# Altium project LimeSDR-PCIe_1v3.PrjPcb (part 2 of 7)

## Sheet 06_LMS7002M_RF2.SchDoc: LMS7002M RF
size A3; Organization: Lime Microsystems; Address1: Surrey Tech Centre; Address2: Guildford GU2 7YG; Address3: Surrey; Address4: United Kingdom; Revision: v1.3; SheetNumber: 6; SheetTotal: 16
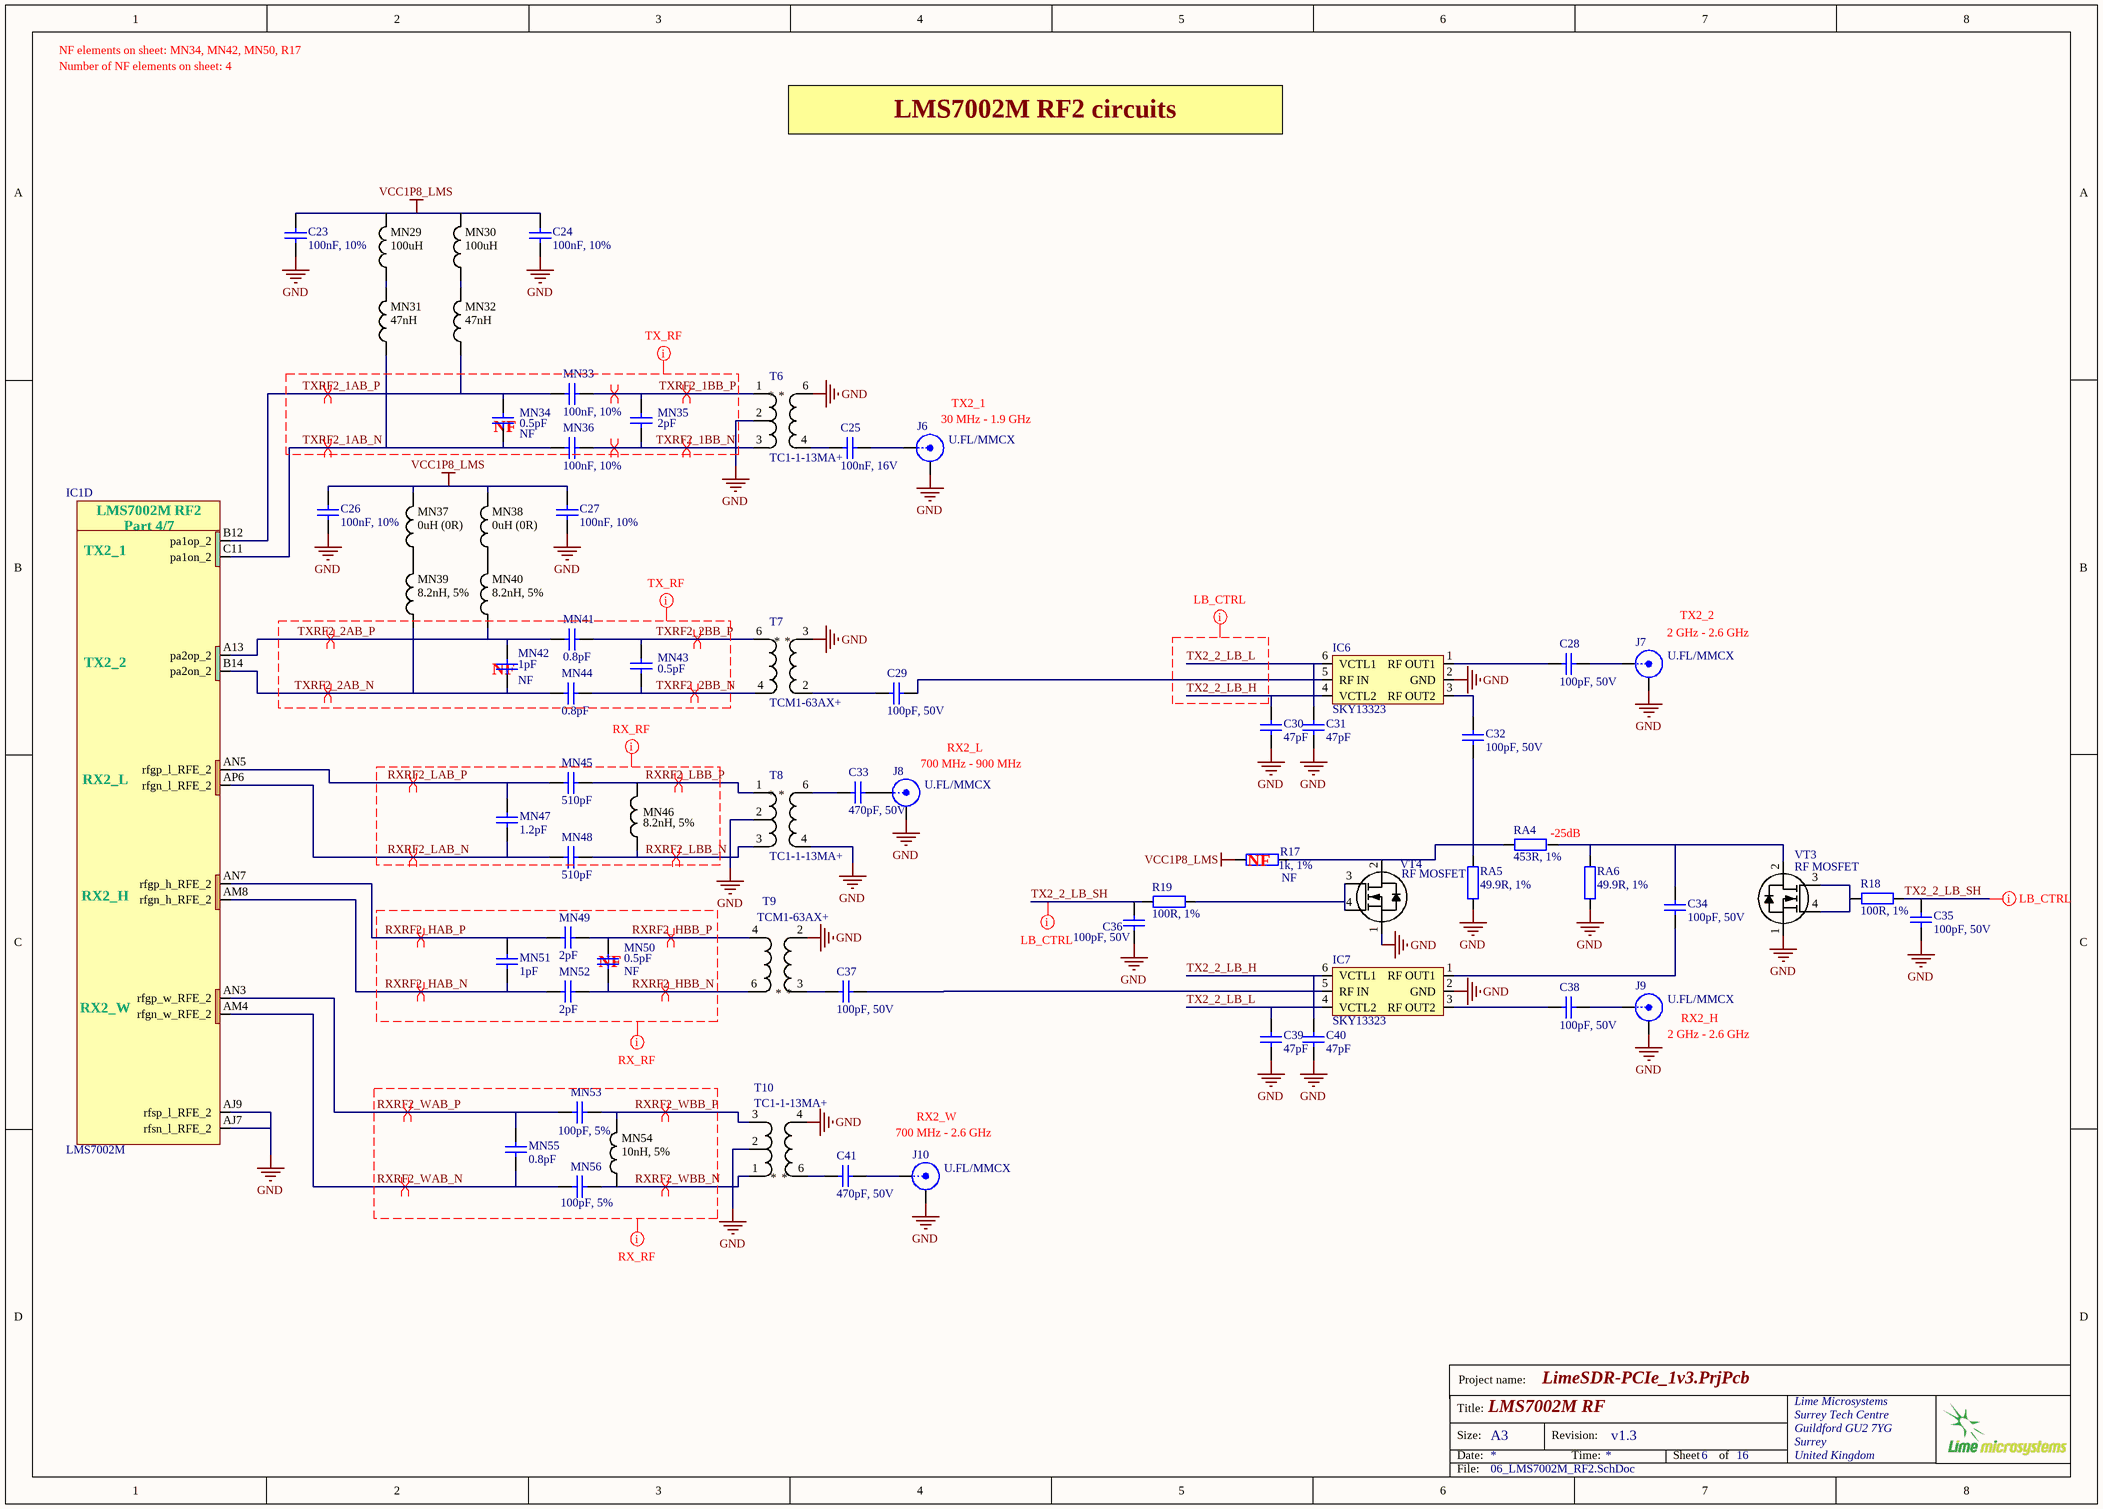
[diagram p5: 06_LMS7002M_RF2.SchDoc]

### Parts
C23  100nF, 10%  [CAP0402]
C24  100nF, 10%  [CAP0402]
C25  100nF, 16V  [CAP0402]
C26  100nF, 10%  [CAP0402]
C27  100nF, 10%  [CAP0402]
C28  100pF, 50V  [CAP0402]
C29  100pF, 50V  [CAP0402]
C30  47pF  [CAP0402]
C31  47pF  [CAP0402]
C32  100pF, 50V  [CAP0402]
C33  470pF, 50V  [CAP0402]
C34  100pF, 50V  [CAP0402]
C35  100pF, 50V  [CAP0402]
C36  100pF, 50V  [CAP0402]
C37  100pF, 50V  [CAP0402]
C38  100pF, 50V  [CAP0402]
C39  47pF  [CAP0402]
C40  47pF  [CAP0402]
C41  470pF, 50V  [CAP0402]
IC1  LMS7002M  [LMS7002M_v2]  (part D of 7)
IC6  SKY13323  [SKY13323-378LF]
IC7  SKY13323  [SKY13323-378LF]
J6  U.FL/MMCX  [MMCX_UFL_conn_u]
J7  U.FL/MMCX  [MMCX_UFL_conn_u]
J8  U.FL/MMCX  [MMCX_UFL_conn_u]
J9  U.FL/MMCX  [MMCX_UFL_conn_u]
J10  U.FL/MMCX  [MMCX_UFL_conn_u]
MN29  100uH  [RES0805]
MN30  100uH  [RES0805]
MN31  47nH  [RES0402]
MN32  47nH  [RES0402]
MN33  100nF, 10%  [CAP0402]
MN34  0.5pF  Assembly Info: NF  [CAP0402]
MN35  2pF  [CAP0402]
MN36  100nF, 10%  [CAP0402]
MN37  0uH (0R)  [RES0805]
MN38  0uH (0R)  [RES0805]
MN39  8.2nH, 5%  [RES0402]
MN40  8.2nH, 5%  [RES0402]
MN41  0.8pF  [CAP0402]
MN42  1pF  Assembly Info: NF  [CAP0402]
MN43  0.5pF  [CAP0402]
MN44  0.8pF  [CAP0402]
MN45  510pF  [CAP0402]
MN46  8.2nH, 5%  [RES0402]
MN47  1.2pF  [CAP0402]
MN48  510pF  [CAP0402]
MN49  2pF  [CAP0402]
MN50  0.5pF  Assembly Info: NF  [CAP0402]
MN51  1pF  [CAP0402]
MN52  2pF  [CAP0402]
MN53  100pF, 5%  [CAP0402]
MN54  10nH, 5%  [RES0402]
MN55  0.8pF  [CAP0402]
MN56  100pF, 5%  [CAP0402]
R17  1k, 1%  Assembly Info: NF  [RES0402]
R18  100R, 1%  [RES0402]
R19  100R, 1%  [RES0402]
RA4  453R, 1%  [RES0402]
RA5  49.9R, 1%  [RES0402]
RA6  49.9R, 1%  [RES0402]
T6  TC1-1-13MA+  [TC1-1-13MA+_v2]
T7  TCM1-63AX+  [TCM1-63AX+_v2]
T8  TC1-1-13MA+  [TC1-1-13MA+_v2]
T9  TCM1-63AX+  [TCM1-63AX+_v2]
T10  TC1-1-13MA+  [TC1-1-13MA+_v2]
VT3  RF MOSFET  [BF1105R_SOT143R4]
VT4  RF MOSFET  [BF1105R_SOT143R4]

### Nets
GND: C23.1 C24.1 C26.1 C27.1 C30.1 C31.1 C35.2 C36.2 C39.1 C40.1 IC1.AJ7(rfsn_l_RFE_2) IC1.AJ9(rfsp_l_RFE_2) IC6.2(GND) IC7.2(GND) J6.2(Y) J7.2(Y) J8.2(Y) J9.2(Y) J10.2(Y) RA5.1 RA6.1 T6.2 T6.6 T7.3 T8.2 T8.4 T9.2 T10.2 T10.4 VT3.1(S) VT4.1(S)
VCC1P8_LMS: C23.2 C24.2 C26.2 C27.2 MN29.2 MN30.2 MN37.2 MN38.2 R17.2
RXRF2_HAB_N: IC1.AM8(rfgn_h_RFE_2) MN51.1 MN52.2
RXRF2_HAB_P: IC1.AN7(rfgp_h_RFE_2) MN49.2 MN51.2
RXRF2_HBB_N: MN50.1 MN52.1 T9.6
RXRF2_HBB_P: MN49.1 MN50.2 T9.4
RXRF2_LAB_N: IC1.AP6(rfgn_l_RFE_2) MN47.1 MN48.2
RXRF2_LAB_P: IC1.AN5(rfgp_l_RFE_2) MN45.2 MN47.2
RXRF2_LBB_N: MN46.1 MN48.1 T8.3
RXRF2_LBB_P: MN45.1 MN46.2 T8.1
RXRF2_WAB_N: IC1.AM4(rfgn_w_RFE_2) MN55.2 MN56.2
RXRF2_WAB_P: IC1.AN3(rfgp_w_RFE_2) MN53.2 MN55.1
RXRF2_WBB_N: MN54.1 MN56.1 T10.1
RXRF2_WBB_P: MN53.1 MN54.2 T10.3
TX2_2_LB_H: C30.2 C40.2 IC6.4(VCTL2) IC7.6(VCTL1)
TX2_2_LB_L: C31.2 C39.2 IC6.6(VCTL1) IC7.4(VCTL2)
TX2_2_LB_SH: C35.1 C36.1 R18.1 R19.2
TXRF2_1AB_N: IC1.C11(pa1on_2) MN31.1 MN34.1 MN36.1
TXRF2_1AB_P: IC1.B12(pa1op_2) MN32.1 MN33.2 MN34.2
TXRF2_1BB_N: MN35.1 MN36.2 T6.3
TXRF2_1BB_P: MN33.1 MN35.2 T6.1
TXRF2_2AB_N: IC1.B14(pa2on_2) MN39.1 MN42.2 MN44.2
TXRF2_2AB_P: IC1.A13(pa2op_2) MN40.1 MN41.2 MN42.1
TXRF2_2BB_N: MN43.1 MN44.1 T7.4
TXRF2_2BB_P: MN41.1 MN43.2 T7.6
NetC25_1: C25.1 J6.1(X)
NetC25_2: C25.2 T6.4
NetC28_1: C28.1 J7.1(X)
NetC28_2: C28.2 IC6.1(RF_OUT1)
NetC29_1: C29.1 IC6.5(RF_IN)
NetC29_2: C29.2 T7.2
NetC32_1: C32.1 IC6.3(RF_OUT2)
NetC32_2: C32.2 R17.1 RA4.1 RA5.2 VT4.2(D)
NetC33_1: C33.1 J8.1(X)
NetC33_2: C33.2 T8.6
NetC34_1: C34.1 RA4.2 RA6.2 VT3.2(D)
NetC34_2: C34.2 IC7.1(RF_OUT1)
NetC37_1: C37.1 IC7.5(RF_IN)
NetC37_2: C37.2 T9.3
NetC38_1: C38.1 J9.1(X)
NetC38_2: C38.2 IC7.3(RF_OUT2)
NetC41_1: C41.1 J10.1(X)
NetC41_2: C41.2 T10.6
NetMN29_1: MN29.1 MN31.2
NetMN30_1: MN30.1 MN32.2
NetMN37_1: MN37.1 MN39.2
NetMN38_1: MN38.1 MN40.2
NetR18_2: R18.2 VT3.3(G2) VT3.4(G1)
NetR19_1: R19.1 VT4.3(G2) VT4.4(G1)

### Layout directives
differential pair: RXRF2_HAB_N, RXRF2_HAB_P, RXRF2_HBB_N, RXRF2_HBB_P, RXRF2_LAB_N, RXRF2_LAB_P, RXRF2_LBB_N, RXRF2_LBB_P, RXRF2_WAB_N, RXRF2_WAB_P, RXRF2_WBB_N, RXRF2_WBB_P, TXRF2_1AB_N, TXRF2_1AB_P, TXRF2_1BB_N, TXRF2_1BB_P, TXRF2_2AB_N, TXRF2_2AB_P, TXRF2_2BB_N, TXRF2_2BB_P
net class TX_RF: TXRF2_1AB_N, TXRF2_1AB_P, TXRF2_1BB_N, TXRF2_1BB_P, TXRF2_2AB_N, TXRF2_2AB_P, TXRF2_2BB_N, TXRF2_2BB_P
net class RX_RF: RXRF2_HAB_N, RXRF2_HAB_P, RXRF2_HBB_N, RXRF2_HBB_P, RXRF2_LAB_N, RXRF2_LAB_P, RXRF2_LBB_N, RXRF2_LBB_P, RXRF2_WAB_N, RXRF2_WAB_P, RXRF2_WBB_N, RXRF2_WBB_P
net class LB_CTRL: TX2_2_LB_H, TX2_2_LB_L, TX2_2_LB_SH

### Notes on the sheet
- Number of NF elements on sheet: 4
- NF elements on sheet: MN34, MN42, MN50, R17
- LMS7002M RF2 circuits
- (near MN34) NF
- (near J6) 30 MHz - 1.9 GHz
- (near J6) TX2_1
- (near J7) 2 GHz - 2.6 GHz
- (near J7) TX2_2
- (near MN42) NF
- (near J8) 700 MHz - 900 MHz
- RX2_L
- (near RA4) -25dB
- (near R17) NF
- (near MN50) NF
- (near J9) 2 GHz - 2.6 GHz
- (near J9) RX2_H
- (near J10) RX2_W
- 700 MHz - 2.6 GHz
- Project name:
- Title:
- Size:
- Date:
- A3
- Revision:
- Time:
- Sheet
- of
- File:
- (in symbol LMS7002Mr3, part D) LMS7002M RF2; Part 4/7; TX2_1; TX2_2; RX2_L; RX2_H; RX2_W

### Library data of the parts
C23 C24 C26 C27 = Cap_0402: Manufacturer: Murata Electronics; Manufacturer Part Number: GRM155R71C104KA88D; Part Description: 0.10µF ±10% 16V X7R Ceramic Capacitor -55°C ~ 125°C Surface Mount, MLCC 0402 (1005 Metric) 0.039" L x 0.020" W (1.00mm x 0.50mm); Voltage Rating DC: 16 V; Type: General Purpose MLCC; Capacitance: 0.1 uF; Case Length: 1 mm; Dielectric: X7R; Case Height: 0.5 mm; Temperature Coefficient / Code: +/- 15 %; Value: 100nF, 10%; Supplier 1: Mouser; Supplier Part Number 1: 81-GRM155R71C104KA88; Case Code - in: 0402; RoHS: RoHS Compliant; Operating Temperature Range: - 55 C to + 125 C; Series: GRM; Termination Style: SMD/SMT; Tolerance: 10 %; Package / Case: 0402 (1005 metric); Maximum Operating Temperature: + 125 C; Case Code - mm: 1005; Minimum Operating Temperature: - 55 C; Product Category: Low & Medium Capacitance SMD Ceramic Chip Capacitors; Packaging: Reel; Product: General Type MLCCs; Category: Multilayer Ceramic Capacitors MLCC - SMD/SMT; Brand: Murata Electronics; Case Width: 0.5 mm; RoHS - Mouser: Y; Standard Pack Qty: 10000; Minimum Order Quantity: 1; Reeling: True; Manufacturer Part Number 1: GRM155R71C104KA88D
C25 = Cap_0402: Manufacturer: Murata Electronics; Manufacturer Part Number: GRM155R71C104KA88D; Part Description: 0.10µF ±10% 16V X7R Ceramic Capacitor -55°C ~ 125°C Surface Mount, MLCC 0402 (1005 Metric) 0.039" L x 0.020" W (1.00mm x 0.50mm); Tolerance: 10 %; Type: General Purpose MLCC; Capacitance: 0.1 uF; Case Length: 1 mm; Dielectric: X7R; Case Height: 0.5 mm; Temperature Coefficient / Code: +/- 15 %; Value: 100nF, 16V; Supplier 1: Mouser; Supplier Part Number 1: 81-GRM155R71C104KA88; Case Code - in: 0402; RoHS: RoHS Compliant; Operating Temperature Range: - 55 C to + 125 C; Series: GRM; Termination Style: SMD/SMT; Package / Case: 0402 (1005 metric); Voltage Rating DC: 16 V; Maximum Operating Temperature: + 125 C; Case Code - mm: 1005; Minimum Operating Temperature: - 55 C; Product Category: Low & Medium Capacitance SMD Ceramic Chip Capacitors; Packaging: Reel; Product: General Type MLCCs; Category: Multilayer Ceramic Capacitors MLCC - SMD/SMT; Brand: Murata Electronics; Case Width: 0.5 mm; RoHS - Mouser: Y; Standard Pack Qty: 10000; Minimum Order Quantity: 1; Reeling: True; Manufacturer Part Number 1: GRM155R71C104KA88D
C28 C29 C32 C34-C38 = Cap_0402: Manufacturer Part Number 1: CC0402JRNPO9BN101; Manufacturer: Yageo; Part Description: 100pF ±5% 50V C0G, NP0 Ceramic Capacitor -55°C ~ 125°C Surface Mount, MLCC 0402 (1005 Metric) 0.039" L x 0.020" W (1.00mm x 0.50mm); Tolerance: ±5%; Temperature Coefficient: C0G, NP0; Value: 100pF, 50V; Capacitance: 100pF; Thickness (Max): 0.022" (0.55mm); Size / Dimension: 0.039" L x 0.020" W (1.00mm x 0.50mm); RoHS: RoHS Compliant; Ratings: -; Package / Case: 0402 (1005 Metric); Mounting Type: Surface Mount, MLCC; Height - Seated (Max): -; Features: -; Lead Spacing: -; Voltage - Rated: 50V; Operating Temperature: -55°C ~ 125°C; Packaging: Cut Tape (CT); Applications: General Purpose; Lead Style: -; Supplier 1: Digi-Key; Category: Capacitors; Supplier Part Number 1: 311-1024-1-ND
C30 C31 C39 C40 = Cap_0402: Manufacturer Part Number 1: C1005C0G1H470F050BA; Manufacturer: TDK Corporation; Part Description: 47pF ±1% 50V C0G, NP0 Ceramic Capacitor -55°C ~ 125°C Surface Mount, MLCC 0402 (1005 Metric) 0.039" L x 0.020" W (1.00mm x 0.50mm); Voltage - Rated: 50V; Temperature Coefficient: C0G, NP0; Tolerance: ±1%; Value: 47pF; Supplier 1: Digi-Key; Supplier Part Number 1: 445-5361-1-ND; Package / Case: 0402 (1005 Metric); Lead Spacing: -; Ratings: -; Mounting Type: Surface Mount, MLCC; Operating Temperature: -55°C ~ 125°C; Thickness (Max): 0.022" (0.55mm); Capacitance: 47pF; Packaging: Cut Tape (CT); Features: -; Applications: General Purpose; Lead Style: -; Size / Dimension: 0.039" L x 0.020" W (1.00mm x 0.50mm); Height - Seated (Max): -; RoHS: RoHS Compliant; Category: Capacitors
C33 C41 = Cap_0402: Manufacturer Part Number: C1005C0G1H471J050BA; Manufacturer: TDK Corporation; Part Description: 470pF ±5% 50V C0G, NP0 Ceramic Capacitor -55°C ~ 125°C Surface Mount, MLCC 0402 (1005 Metric) 0.039" L x 0.020" W (1.00mm x 0.50mm); Tolerance: ±5%; Temperature Coefficient: C0G, NP0; Value: 470pF, 50V; Supplier 1: Digi-Key; Supplier Part Number 1: 445-2656-6-ND; Ratings: -; Package / Case: 0402 (1005 Metric); Capacitance: 470pF; Packaging: Digi-Reel®; RoHS: RoHS Compliant; Lead Style: -; Thickness (Max): 0.022" (0.55mm); Size / Dimension: 0.039" L x 0.020" W (1.00mm x 0.50mm); Lead Spacing: -; Operating Temperature: -55°C ~ 125°C; Height - Seated (Max): -; Applications: General Purpose; Mounting Type: Surface Mount, MLCC; Voltage - Rated: 50V; Category: Capacitors; Features: -
IC1 = LMS7002Mr3: Schematic symbol revision 3. Default footprint - 0.31mm pad; Manufacturer: Lime Microsystems; Part Description: IC FPRF Transceiver LMS7002M; 261 pin aQFN; Supplier 1: Lime Microsystems; Supplier Part Number 1: LMS7002M; Manufacturer Part Number 1: LMS7002M
IC6 IC7 = SKY13323: SKY13323-378LF: 0.1-3.0 GHz GaAs SPDT Switch; Manufacturer: Skyworks Solutions Inc.; Part Description: IC SPDT 100MHZ-3GHZ 6-MLPD; Frequency - Lower: 100MHz; P1dB: 27dBm (typ) IP1dB; Isolation @ Frequency: 27dB @ 3GHz (typ); RF Type: 802.11b/g; Impedance: 50 Ohm; IIP3: 50dBm (typ); Topology: Reflective; Insertion Loss @ Frequency: 0.35dB @ 3GHz; Frequency - Upper: 3GHz; Supplier 1: Digi-Key; Operating Temperature: -40°C ~ 85°C; RoHS: RoHS Compliant; Package / Case: 6-XFDFN Exposed Pad; Circuit: SPDT; Features: -; Supplier Device Package: 6-MLPD (1x1); Category: RF/IF and RFID; Packaging: Cut Tape (CT); Manufacturer Part Number 1: SKY13323-378LF; Supplier Part Number 1: 683-1334-1-ND
J6-J10 = RF_IF_connector: CONN UMC RCPT STR 50 OHM SMD; Manufacturer: Molex, LLC; Manufacturer Part Number 1: 0734120110; Body Finish: Nickel; Body Material: Phosphor Bronze; Center Contact Material: Brass; Center Contact Plating: Gold; Connector Style: Ultra Miniature Coaxial; Connector Type: Jack, Male Pin; Contact Termination: Solder; Dielectric Material: Liquid Crystal Polymer (LCP); Frequency - Max: 6GHz; Impedance: 50 Ohm; Voltage Rating: 60V; Cable Group: -; Category: Connectors, Interconnects; Fastening Type: Snap-On; Features: -; Housing Color: Silver; Ingress Protection: -; Mounting Type: Surface Mount; Operating Temperature: -40°C ~ 90°C; Packaging: Cut Tape (CT); RoHS: RoHS Compliant; Shield Termination: Solder; Supplier 1: Digi-Key; Supplier Part Number 1: WM5587CT-ND; Part Description: CONN UMC RCPT STR 50 OHM SMD
MN29 MN30 = Inductor_0603: Manufacturer: TDK Corporation; Manufacturer Part Number: MLF2012C101KT000; Part Description: FIXED IND 100UH 2MA 3.1 OHM SMD; Q @ Freq: 25 @ 1MHz; Shielding: Shielded; Current Rating: 2mA; Frequency - Self Resonant: 7MHz; Frequency - Test: 1MHz; Material - Core: Ferrite; Tolerance: ±10%; Inductance: 100µH; DC Resistance (DCR): 3.1 Ohm Max; Value: 100uH; Supplier 1: Digi-Key; Supplier Part Number 1: 445-1071-1-ND; Supplier Device Package: 0805 (2012 Metric); Size / Dimension: 0.079" L x 0.049" W (2.00mm x 1.25mm); Operating Temperature: -40°C ~ 85°C; Packaging: Cut Tape (CT); RoHS: RoHS Compliant; Current - Saturation: -; Height - Seated (Max): 0.057" (1.45mm); Package / Case: 0805 (2012 Metric); Mounting Type: Surface Mount; Type: Multilayer; Category: Inductors, Coils, Chokes
MN31 MN32 = Inductor_0603: Manufacturer: COILCRAFT; Manufacturer Part Number: 0402HP-47NXJLU; Part Description: Surface Mount High Frequency Inductor, 0402HP Series, 47 nH, ± 5%, 0402 [1005 Metric], 2.4 GHz; SVHC: No SVHC (15-Jun-2015); Inductance Tolerance: ± 5%; High Frequency Inductor Case: 0402 [1005 Metric]; Inductor Case Style: 0402 [1005 Metric]<!--FANDB--><div class="features-and-benefits-container"></div>; Inductance: 47; DC Resistance Max: 0.58; Self Resonant Frequency Min: 2.4; Product Range: 0402; DC Current Rating: 420; Inductor Construction: Wirewound; Supplier 1: Farnell; Supplier Part Number 1: 2285856; Packaging: Cut Tape; RoHS: Y-EX; value: 47nH
MN33 MN36 = Cap_0402: Manufacturer: Murata Electronics; Manufacturer Part Number: GRM155R71C104KA88D; Part Description: 0.10µF ±10% 16V X7R Ceramic Capacitor -55°C ~ 125°C Surface Mount, MLCC 0402 (1005 Metric) 0.039" L x 0.020" W (1.00mm x 0.50mm); Voltage Rating DC: 16 V; Capacitance: 0.1 uF; Case Length: 1 mm; Dielectric: X7R; Case Height: 0.5 mm; Temperature Coefficient / Code: +/- 15 %; Value: 100nF, 10%; Supplier 1: Mouser; Supplier Part Number 1: 81-GRM155R71C104KA88; Case Code - in: 0402; RoHS: RoHS Compliant; Operating Temperature Range: - 55 C to + 125 C; Series: GRM; Termination Style: SMD/SMT; Tolerance: 10 %; Package / Case: 0402 (1005 metric); Type: General Purpose MLCC; Maximum Operating Temperature: + 125 C; Case Code - mm: 1005; Minimum Operating Temperature: - 55 C; Product Category: Low & Medium Capacitance SMD Ceramic Chip Capacitors; Packaging: Reel; Product: General Type MLCCs; Category: Multilayer Ceramic Capacitors MLCC - SMD/SMT; Brand: Murata Electronics; Case Width: 0.5 mm; RoHS - Mouser: Y; Standard Pack Qty: 10000; Minimum Order Quantity: 1; Reeling: True; Manufacturer Part Number 1: GRM155R71C104KA88D
MN34 MN43 MN50 = Cap_0402: Manufacturer: Yageo; Manufacturer Part Number 1: CC0402CRNPO9BNR50; Part Description: 0.50pF ±0.25pF 50V C0G, NP0 Ceramic Capacitor -55°C ~ 125°C Surface Mount, MLCC 0402 (1005 Metric) 0.039" L x 0.020" W (1.00mm x 0.50mm); Capacitance: 0.50pF; Voltage - Rated: 50V; Temperature Coefficient: C0G, NP0; Tolerance: ±0.25pF; Value: 0.5pF; Supplier 1: Digi-Key; Supplier Part Number 1: 311-1001-1-ND; RoHS: RoHS Compliant; Thickness (Max): 0.022" (0.55mm); Features: -; Height - Seated (Max): -; Lead Spacing: -; Applications: General Purpose; Packaging: Cut Tape (CT); Ratings: -; Size / Dimension: 0.039" L x 0.020" W (1.00mm x 0.50mm); Lead Style: -; Mounting Type: Surface Mount, MLCC; Operating Temperature: -55°C ~ 125°C; Package / Case: 0402 (1005 Metric); Category: Capacitors
MN35 MN49 MN52 = Cap_0402: Manufacturer Part Number: 04025U2R0BAT2A; Manufacturer: AVX; Part Description: SMD Multilayer Ceramic Capacitor, U Series, 2 pF, ± 0.1pF, C0G / NP0, 50 V, 0402 [1005 Metric]; Product Range: U Series; Voltage Rating: 50; SVHC: No SVHC (17-Dec-2014); Capacitance Tolerance: ± 0.1; Ceramic Capacitor Case: 0402 [1005 Metric]; Capacitance: 2; Dielectric Characteristic: C0G / NP0; Value: 2pF; Supplier 1: Farnell; Supplier Part Number 1: 2332536; Operating Temperature Max: 125; RoHS: YES; Operating Temperature Min: -55; Capacitance Tolerance ±: ± 0.1; Packaging: Cut Tape; MSL: MSL 1 - Unlimited
MN37 MN38 = Inductor_0603: Manufacturer: BOURNS; Manufacturer Part Number: CR0805-J/-000ELF; Part Description: Surface Mount Chip Resistor, Thick Film, CR Series, 0 ohm, 125 mW, ± 5%, 150 V, 0805 [2012 Metric]; Value: 0uH (0R); Supplier 1: Farnell; Supplier Part Number 1: 2008388; RoHS: YES
MN39 MN40 MN46 = Inductor_0603: Manufacturer: COILCRAFT; Manufacturer Part Number 1: 0402HP-8N2XJLU; Part Description: Surface Mount High Frequency Inductor, 0402HP Series, 8.2 nH, ± 5%, 0402 [1005 Metric], 5.4 GHz; Inductor Construction: Wirewound; DC Current Rating: 1.5; Inductor Case Style: 0402 [1005 Metric]<!--FANDB--><div class="features-and-benefits-container"></div>; Self Resonant Frequency Min: 5.4; DC Resistance Max: 0.065; High Frequency Inductor Case: 0402 [1005 Metric]; SVHC: No SVHC (16-Jun-2014); Inductance: 8.2; Supplier 1: Farnell; Supplier Part Number 1: 2285826; Packaging: Cut Tape; Product Range: COILCRAFT - 0402; Inductance Tolerance: ± 5%; RoHS: Y-EX; Value: 8.2nH, 5%
MN41 MN44 MN55 = Cap_0402: Manufacturer: Murata Electronics North America; Manufacturer Part Number: GRM1555C1HR80BA01D; Part Description: 0.80pF ±0.1pF 50V C0G, NP0 Ceramic Capacitor -55°C ~ 125°C Surface Mount, MLCC 0402 (1005 Metric) 0.039" L x 0.020" W (1.00mm x 0.50mm); Temperature Coefficient: C0G, NP0; Capacitance: 0.80pF; Voltage - Rated: 50V; Tolerance: ±0.1pF; Value: 0.8pF; Applications: General Purpose; Operating Temperature: -55°C ~ 125°C; Size / Dimension: 0.039" L x 0.020" W (1.00mm x 0.50mm); Features: -; Supplier 1: Digi-Key; Height - Seated (Max): -; Category: Capacitors; Package / Case: 0402 (1005 Metric); Mounting Type: Surface Mount, MLCC; Lead Spacing: -; Thickness (Max): 0.022" (0.55mm); RoHS: RoHS Compliant; Supplier Part Number 1: 490-6269-1-ND; Packaging: Cut Tape (CT); Ratings: -; Lead Style: -
MN42 MN51 = Cap_0402: Manufacturer: TDK Corporation; Manufacturer Part Number 1: C1005C0G1H010B050BA; Part Description: 1pF ±0.1pF 50V C0G, NP0 Ceramic Capacitor -55°C ~ 125°C Surface Mount, MLCC 0402 (1005 Metric) 0.039" L x 0.020" W (1.00mm x 0.50mm); Voltage - Rated: 50V; Temperature Coefficient: C0G, NP0; Tolerance: ±0.1pF; Value: 1pF; Supplier 1: Digi-Key; Supplier Part Number 1: 445-4854-6-ND; Size / Dimension: 0.039" L x 0.020" W (1.00mm x 0.50mm); Lead Spacing: -; Operating Temperature: -55°C ~ 125°C; Thickness (Max): 0.022" (0.55mm); Package / Case: 0402 (1005 Metric); Features: -; Lead Style: -; Applications: General Purpose; Height - Seated (Max): -; Capacitance: 1pF; RoHS: RoHS Compliant; Mounting Type: Surface Mount, MLCC; Packaging: Digi-Reel®; Ratings: -; Category: Capacitors
MN45 MN48 = Cap_0402: Manufacturer: Murata Electronics North America; Manufacturer Part Number: GRM1555C1H511JA01D; Part Description: 510pF ±5% 50V C0G, NP0 Ceramic Capacitor -55°C ~ 125°C Surface Mount, MLCC 0402 (1005 Metric) 0.039" L x 0.020" W (1.00mm x 0.50mm); Voltage - Rated: 50V; Temperature Coefficient: C0G, NP0; Tolerance: ±5%; Value: 510pF; Supplier 1: Digi-Key; Supplier Part Number 1: 490-3237-1-ND; Height - Seated (Max): -; Features: -; Size / Dimension: 0.039" L x 0.020" W (1.00mm x 0.50mm); Applications: General Purpose; Lead Spacing: -; Package / Case: 0402 (1005 Metric); Ratings: -; Thickness (Max): 0.022" (0.55mm); Lead Style: -; Operating Temperature: -55°C ~ 125°C; Mounting Type: Surface Mount, MLCC; Capacitance: 510pF; Category: Capacitors; RoHS: RoHS Compliant; Packaging: Cut Tape (CT)
MN47 = Cap_0402: Manufacturer: Murata Electronics North America; Manufacturer Part Number: GRM1555C1H1R2CA01D; Part Description: 1.2pF ±0.25pF 50V C0G, NP0 Ceramic Capacitor -55°C ~ 125°C Surface Mount, MLCC 0402 (1005 Metric) 0.039" L x 0.020" W (1.00mm x 0.50mm); Temperature Coefficient: C0G, NP0; Voltage - Rated: 50V; Tolerance: ±0.25pF; Value: 1.2pF; Supplier 1: Digi-Key; Supplier Part Number 1: 490-5927-1-ND; Lead Style: -; Category: Capacitors; Features: -; Packaging: Cut Tape (CT); Operating Temperature: -55°C ~ 125°C; Package / Case: 0402 (1005 Metric); Applications: General Purpose; Size / Dimension: 0.039" L x 0.020" W (1.00mm x 0.50mm); Lead Spacing: -; Ratings: -; Mounting Type: Surface Mount, MLCC; RoHS: RoHS Compliant; Height - Seated (Max): -; Thickness (Max): 0.022" (0.55mm); Capacitance: 1.2pF
MN53 MN56 = Cap_0402: Manufacturer Part Number 1: CC0402JRNPO9BN101; Manufacturer: Yageo; Part Description: 100pF ±5% 50V C0G, NP0 Ceramic Capacitor -55°C ~ 125°C Surface Mount, MLCC 0402 (1005 Metric) 0.039" L x 0.020" W (1.00mm x 0.50mm); Temperature Coefficient: C0G, NP0; Voltage - Rated: 50V; Value: 100pF, 5%; Capacitance: 100pF; Thickness (Max): 0.022" (0.55mm); Size / Dimension: 0.039" L x 0.020" W (1.00mm x 0.50mm); Tolerance: ±5%; RoHS: RoHS Compliant; Ratings: -; Package / Case: 0402 (1005 Metric); Mounting Type: Surface Mount, MLCC; Height - Seated (Max): -; Features: -; Lead Spacing: -; Operating Temperature: -55°C ~ 125°C; Packaging: Cut Tape (CT); Applications: General Purpose; Lead Style: -; Supplier 1: Digi-Key; Category: Capacitors; Supplier Part Number 1: 311-1024-1-ND
MN54 = Inductor_0603: Manufacturer Part Number 1: 0402HP-10NXJLU; Manufacturer: COILCRAFT; Part Description: Surface Mount High Frequency Inductor, 0402HP Series, 10 nH, ± 5%, 0402 [1005 Metric], 4.7 GHz; Value: 10nH, 5%; Supplier 1: Farnell; Supplier Part Number 1: 2285830; RoHS: Y-EX
R17 = Res_0402: Manufacturer: Stackpole Electronics Inc; Manufacturer Part Number 1: RMCF0402FT1K00; Part Description: RES SMD 1K OHM 1% 1/16W 0402; Temperature Coefficient: ±100ppm/°C; Power (Watts): 0.063W, 1/16W; Value: 1k, 1%; Supplier 1: Digi-Key; Supplier Part Number 1: RMCF0402FT1K00TR-ND; Resistance (Ohms): 1k; Packaging: Tape & Reel (TR); Category: Resistors; RoHS: RoHS Compliant; Tolerance: ±1%; Height: 0.016" (0.40mm); Number of Terminations: 2; Package / Case: 0402 (1005 Metric); Operating Temperature: -55°C ~ 155°C; Features: -; Composition: Thick Film; Supplier Device Package: 0402; Size / Dimension: 0.039" L x 0.020" W (1.00mm x 0.50mm)
R18 R19 = Res_0402: Manufacturer Part Number 1: RMCF0402FT100R; Part Description: RES SMD 100 OHM 1% 1/16W 0402; Manufacturer: Stackpole Electronics Inc.; Temperature Coefficient: ±100ppm/°C; Supplier 1: Digi-Key; Supplier Part Number 1: RMCF0402FT100RDKR-ND; Package / Case: 0402 (1005 Metric); Composition: Thick Film; Category: Resistors; Tolerance: ±1%; Value: 100R, 1%
RA4 = Res_0402: Manufacturer Part Number 1: RC0402FR-07453RL; Manufacturer: Yageo; Part Description: RES SMD 453 OHM 1% 1/16W 0402; Temperature Coefficient: ±100ppm/°C; Power (Watts): 0.063W, 1/16W; Resistance (Ohms): 453; Size / Dimension: 0.039" L x 0.020" W (1.00mm x 0.50mm); Height: 0.016" (0.40mm); Number of Terminations: 2; Failure Rate: -; Package / Case: 0402 (1005 Metric); Supplier Device Package: 0402; Supplier Part Number 1: YAG3165CT-ND; Supplier 1: Digi-Key; Part Status: Active; Category: Resistors; RoHS: RoHS Compliant; Packaging: Cut Tape (CT); Operating Temperature: -55°C ~ 155°C; Features: Moisture Resistant; Composition: Thick Film; Tolerance: ±1%; Value: 453R, 1%
RA5 RA6 = Res_0402: as R6 on sheet 04_LMS7002M_Misc; Number of Terminations: 2; Size / Dimension: 0.039" L x 0.020" W (1.00mm x 0.50mm); Supplier Device Package: 0402 (1005 Metric); RoHS: RoHS Compliant; Supplier Part Number 1: 1276-3469-6-ND; Features: -; Packaging: Digi-Reel®; Tolerance: ±1%; Height: 0.016" (0.40mm); Category: Resistors; Composition: Thick Film; Package / Case: 0402 (1005 Metric); Supplier 1: Digi-Key; Operating Temperature: -55°C ~ 155°C; Value: 49.9R, 1%
T6 T8 T10 = Balun: Manufacturer: Mini-Circuits; Part Description: RF balun, TC1-1-13MA+; Manufacturer Part Number 1: TC1-1-13MA+; Supplier Part Number 1: TC1-1-13MA+; Supplier 1: Minicircuits
T7 T9 = Balun_v2: Manufacturer: Mini-circuits; Part Description: RF balun, TCM1-63AX+; Supplier Part Number 1: TCM1-63AX+; Manufacturer Part Number 1: TCM1-63AX+; Supplier 1: Minicircuits
VT3 VT4 = BF1105R,215: Manufacturer: NXP Semiconductors; Part Description: RF MOSFET Transistors Trans MOSFET N-CH 7V 0.03A 4pin(3+Tab); Voltage - Rated: 7V; Noise Figure: 1.7dB; Current Rating: 30mA; Gain: 20dB; Transistor Type: N-Channel Dual Gate; Frequency: 800MHz; Voltage - Test: 5V; Supplier 1: Digi-Key; RoHS: RoHS Compliant; Supplier Device Package: SOT-143R; Power - Output: -; Current - Test: -; Manufacturer Part Number 1: BF1105R,215; Packaging: Digi-Reel®; Package / Case: SOT-143R; Category: Discrete Semiconductor Products; Supplier Part Number 1: 568-12530-6-ND

## Sheet 07_LMS7002M_Power.SchDoc: LMS7002M power supply
size A3 portrait; Organization: Lime Microsystems; Address1: Surrey Tech Centre; Address2: Guildford GU2 7YG; Address3: Surrey; Address4: United Kingdom; Revision: v1.3; SheetNumber: 7; SheetTotal: 16; PageSetup: Record=PageOptions|CenterHorizontal=True|CenterVertical=True|PrintScale=0.70|XCorrection=1.00|YCorrection=1.00|PrintKind=1|BorderSize=5000000|LeftOffset=0|BottomOffset=0|Orientation=1|PaperLength=2970|PaperWidth=2100|Scale=100|PaperSource=7|PrintQuality=600|MediaType=1|DitherType=10|PrintScaleMode=1|PaperKind=A4|PaperIndex=9
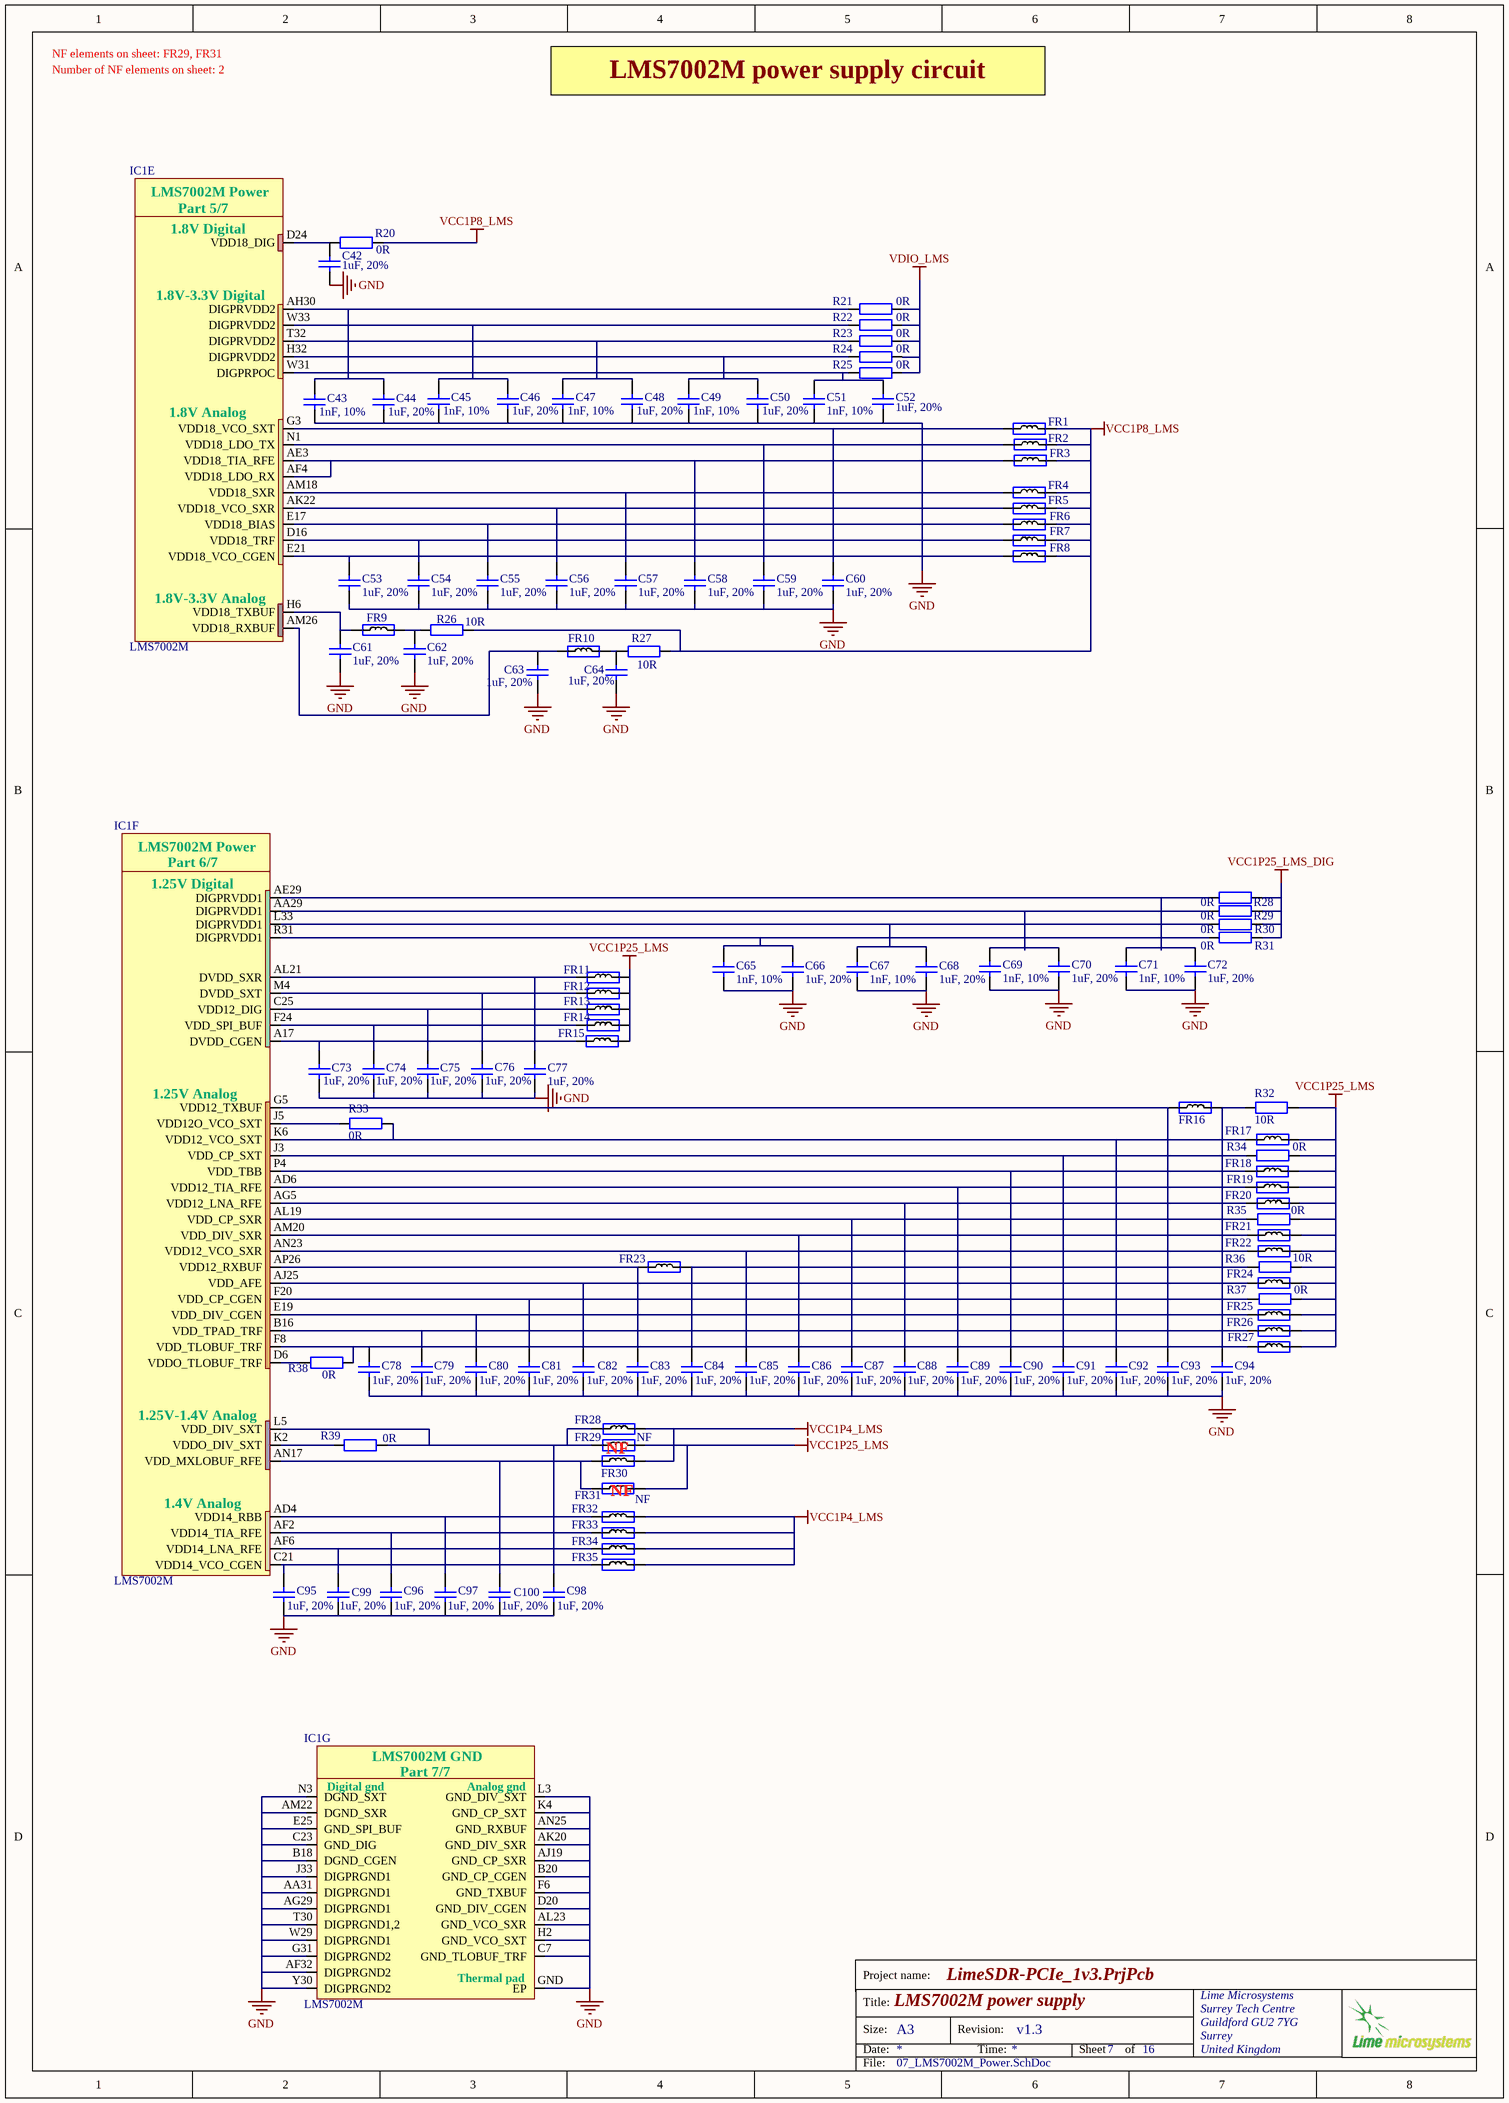
[diagram p6: 07_LMS7002M_Power.SchDoc]

### Parts
C42  1uF, 20%  [CAP0201]
C43  1nF, 10%  [CAP0201]
C44  1uF, 20%  [CAP0201]
C45  1nF, 10%  [CAP0201]
C46  1uF, 20%  [CAP0201]
C47  1nF, 10%  [CAP0201]
C48  1uF, 20%  [CAP0201]
C49  1nF, 10%  [CAP0201]
C50  1uF, 20%  [CAP0201]
C51  1nF, 10%  [CAP0201]
C52  1uF, 20%  [CAP0201]
C53  1uF, 20%  [CAP0201]
C54  1uF, 20%  [CAP0201]
C55  1uF, 20%  [CAP0201]
C56  1uF, 20%  [CAP0201]
C57  1uF, 20%  [CAP0201]
C58  1uF, 20%  [CAP0201]
C59  1uF, 20%  [CAP0201]
C60  1uF, 20%  [CAP0201]
C61  1uF, 20%  [CAP0201]
C62  1uF, 20%  [CAP0201]
C63  1uF, 20%  [CAP0201]
C64  1uF, 20%  [CAP0201]
C65  1nF, 10%  [CAP0201]
C66  1uF, 20%  [CAP0201]
C67  1nF, 10%  [CAP0201]
C68  1uF, 20%  [CAP0201]
C69  1nF, 10%  [CAP0201]
C70  1uF, 20%  [CAP0201]
C71  1nF, 10%  [CAP0201]
C72  1uF, 20%  [CAP0201]
C73  1uF, 20%  [CAP0201]
C74  1uF, 20%  [CAP0201]
C75  1uF, 20%  [CAP0201]
C76  1uF, 20%  [CAP0201]
C77  1uF, 20%  [CAP0201]
C78  1uF, 20%  [CAP0201]
C79  1uF, 20%  [CAP0201]
C80  1uF, 20%  [CAP0201]
C81  1uF, 20%  [CAP0201]
C82  1uF, 20%  [CAP0201]
C83  1uF, 20%  [CAP0201]
C84  1uF, 20%  [CAP0201]
C85  1uF, 20%  [CAP0201]
C86  1uF, 20%  [CAP0201]
C87  1uF, 20%  [CAP0201]
C88  1uF, 20%  [CAP0201]
C89  1uF, 20%  [CAP0201]
C90  1uF, 20%  [CAP0201]
C91  1uF, 20%  [CAP0201]
C92  1uF, 20%  [CAP0201]
C93  1uF, 20%  [CAP0201]
C94  1uF, 20%  [CAP0201]
C95  1uF, 20%  [CAP0201]
C96  1uF, 20%  [CAP0201]
C97  1uF, 20%  [CAP0201]
C98  1uF, 20%  [CAP0201]
C99  1uF, 20%  [CAP0201]
C100  1uF, 20%  [CAP0201]
FR1  600R, 0.27A  [RES0201]  (value not drawn)
FR2  600R, 0.27A  [RES0201]  (value not drawn)
FR3  600R, 0.27A  [RES0201]  (value not drawn)
FR4  600R, 0.27A  [RES0201]  (value not drawn)
FR5  600R, 0.27A  [RES0201]  (value not drawn)
FR6  600R, 0.27A  [RES0201]  (value not drawn)
FR7  600R, 0.27A  [RES0201]  (value not drawn)
FR8  600R, 0.27A  [RES0201]  (value not drawn)
FR9  600R, 0.27A  [RES0201]  (value not drawn)
FR10  600R, 0.27A  [RES0201]  (value not drawn)
FR11  600R, 0.27A  [RES0201]  (value not drawn)
FR12  600R, 0.27A  [RES0201]  (value not drawn)
FR13  600R, 0.27A  [RES0201]  (value not drawn)
FR14  600R, 0.27A  [RES0201]  (value not drawn)
FR15  600R, 0.27A  [RES0201]  (value not drawn)
FR16  600R, 0.27A  [RES0201]  (value not drawn)
FR17  600R, 0.27A  [RES0201]  (value not drawn)
FR18  600R, 0.27A  [RES0201]  (value not drawn)
FR19  600R, 0.27A  [RES0201]  (value not drawn)
FR20  600R, 0.27A  [RES0201]  (value not drawn)
FR21  600R, 0.27A  [RES0201]  (value not drawn)
FR22  600R, 0.27A  [RES0201]  (value not drawn)
FR23  600R, 0.27A  [RES0201]  (value not drawn)
FR24  600R, 0.27A  [RES0201]  (value not drawn)
FR25  600R, 0.27A  [RES0201]  (value not drawn)
FR26  600R, 0.27A  [RES0201]  (value not drawn)
FR27  600R, 0.27A  [RES0201]  (value not drawn)
FR28  600R, 0.27A  [RES0201]  (value not drawn)
FR29  Assembly Info: NF  [RES0201]  (hidden comment: 600R, 0.27A)
FR30  600R, 0.27A  [RES0201]  (value not drawn)
FR31  Assembly Info: NF  [RES0201]  (hidden comment: 600R, 0.27A)
FR32  600R, 0.27A  [RES0201]  (value not drawn)
FR33  600R, 0.27A  [RES0201]  (value not drawn)
FR34  600R, 0.27A  [RES0201]  (value not drawn)
FR35  600R, 0.27A  [RES0201]  (value not drawn)
IC1  LMS7002M  [LMS7002M_v2]  (parts E,F,G of 7)
R20  0R  [RES0201]
R21  0R  [RES0402]
R22  0R  [RES0402]
R23  0R  [RES0402]
R24  0R  [RES0402]
R25  0R  [RES0402]
R26  10R  [RES0201]
R27  10R  [RES0201]
R28  0R  [RES0402]
R29  0R  [RES0402]
R30  0R  [RES0402]
R31  0R  [RES0402]
R32  10R  [RES0201]
R33  0R  [RES0201]
R34  0R  [RES0201]
R35  0R  [RES0201]
R36  10R  [RES0201]
R37  0R  [RES0201]
R38  0R  [RES0201]
R39  0R  [RES0201]

### Nets
GND: C42.2 C43.2 C44.2 C45.2 C46.2 C47.2 C48.2 C49.2 C50.2 C51.2 C52.2 C53.2 C54.2 C55.2 C56.2 C57.2 C58.2 C59.2 C60.2 C61.2 C62.2 C63.2 C64.2 C65.2 C66.2 C67.2 C68.2 C69.2 C70.2 C71.2 C72.2 C73.2 C74.2 C75.2 C76.2 C77.2 C78.2 C79.2 C80.2 C81.2 C82.2 C83.2 C84.2 C85.2 C86.2 C87.2 C88.2 C89.2 C90.2 C91.2 C92.1 C93.2 C94.2 C95.2 C96.2 C97.2 C98.2 C99.2 C100.2 IC1.AA31(DIGPRGND1) IC1.AF32(DIGPRGND2) IC1.AG29(DIGPRGND1) IC1.AJ19(GND_CP_SXR) IC1.AK20(GND_DIV_SXR) IC1.AL23(GND_VCO_SXR) IC1.AM22(DGND_SXR) IC1.AN25(GND_RXBUF) IC1.B18(DGND_CGEN) IC1.B20(GND_CP_CGEN) IC1.C7(GND_TLOBUF_TRF) IC1.C23(GND_DIG) IC1.D20(GND_DIV_CGEN) IC1.E25(GND_SPI_BUF) IC1.F6(GND_TXBUF) IC1.G31(DIGPRGND2) IC1.GND(EP) IC1.H2(GND_VCO_SXT) IC1.J33(DIGPRGND1) IC1.K4(GND_CP_SXT) IC1.L3(GND_DIV_SXT) IC1.N3(DGND_SXT) IC1.T30(DIGPRGND1,2) IC1.W29(DIGPRGND1) IC1.Y30(DIGPRGND2)
VCC1P4_LMS: FR28.1 FR30.2 FR32.2 FR33.2 FR34.2 FR35.2
VCC1P8_LMS: FR1.2 FR2.1 FR3.1 FR4.2 FR5.2 FR6.2 FR7.2 FR8.2 R20.2 R26.2 R27.1
VCC1P25_LMS: FR11.1 FR12.1 FR13.1 FR14.1 FR15.2 FR17.1 FR18.1 FR19.1 FR20.1 FR21.2 FR22.2 FR24.2 FR25.2 FR26.2 FR27.2 FR29.1 FR31.2 R32.2 R34.2 R35.1 R36.1 R37.1
VCC1P25_LMS_DIG: R28.2 R29.2 R30.2 R31.2
VDIO_LMS: R21.1 R22.1 R23.1 R24.1 R25.1
NetC42_1: C42.1 IC1.D24(VDD18_DIG) R20.1
NetC43_1: C43.1 C44.1 IC1.AH30(DIGPRVDD2) R21.2
NetC45_1: C45.1 C46.1 IC1.W33(DIGPRVDD2) R22.2
NetC47_1: C47.1 C48.1 IC1.T32(DIGPRVDD2) R23.2
NetC49_1: C49.1 C50.1 IC1.H32(DIGPRVDD2) R24.2
NetC51_1: C51.1 C52.1 IC1.W31(DIGPRPOC) R25.2
NetC53_1: C53.1 FR8.1 IC1.E21(VDD18_VCO_CGEN)
NetC54_1: C54.1 FR7.1 IC1.D16(VDD18_TRF)
NetC55_1: C55.1 FR6.1 IC1.E17(VDD18_BIAS)
NetC56_1: C56.1 FR5.1 IC1.AK22(VDD18_VCO_SXR)
NetC57_1: C57.1 FR4.1 IC1.AM18(VDD18_SXR)
NetC58_1: C58.1 FR3.2 IC1.AE3(VDD18_TIA_RFE) IC1.AF4(VDD18_LDO_RX)
NetC59_1: C59.1 FR2.2 IC1.N1(VDD18_LDO_TX)
NetC60_1: C60.1 FR1.1 IC1.G3(VDD18_VCO_SXT)
NetC61_1: C61.1 FR9.2 IC1.H6(VDD18_TXBUF)
NetC62_1: C62.1 FR9.1 R26.1
NetC63_1: C63.1 FR10.1 IC1.AM26(VDD18_RXBUF)
NetC64_1: C64.1 FR10.2 R27.2
NetC65_1: C65.1 C66.1 IC1.R31(DIGPRVDD1) R31.1
NetC67_1: C67.1 C68.1 IC1.L33(DIGPRVDD1) R30.1
NetC69_1: C69.1 C70.1 IC1.AA29(DIGPRVDD1) R29.1
NetC71_1: C71.1 C72.1 IC1.AE29(DIGPRVDD1) R28.1
NetC73_1: C73.1 FR15.1 IC1.A17(DVDD_CGEN)
NetC74_1: C74.1 FR14.2 IC1.F24(VDD_SPI_BUF)
NetC75_1: C75.1 FR13.2 IC1.C25(VDD12_DIG)
NetC76_1: C76.1 FR12.2 IC1.M4(DVDD_SXT)
NetC77_1: C77.1 FR11.2 IC1.AL21(DVDD_SXR)
NetC78_1: C78.1 FR27.1 IC1.F8(VDD_TLOBUF_TRF) R38.1
NetC79_1: C79.1 FR26.1 IC1.B16(VDD_TPAD_TRF)
NetC80_1: C80.1 FR25.1 IC1.E19(VDD_DIV_CGEN)
NetC81_1: C81.1 IC1.F20(VDD_CP_CGEN) R37.2
NetC82_1: C82.1 FR24.1 IC1.AJ25(VDD_AFE)
NetC83_1: C83.1 FR23.1 IC1.AP26(VDD12_RXBUF)
NetC84_1: C84.1 FR23.2 R36.2
NetC85_1: C85.1 FR22.1 IC1.AN23(VDD12_VCO_SXR)
NetC86_1: C86.1 FR21.1 IC1.AM20(VDD_DIV_SXR)
NetC87_1: C87.1 IC1.AL19(VDD_CP_SXR) R35.2
NetC88_1: C88.1 FR20.2 IC1.AG5(VDD12_LNA_RFE)
NetC89_1: C89.1 FR19.2 IC1.AD6(VDD12_TIA_RFE)
NetC90_1: C90.1 FR18.2 IC1.P4(VDD_TBB)
NetC91_1: C91.1 IC1.J3(VDD_CP_SXT) R34.1
NetC92_2: C92.2 FR17.2 IC1.K6(VDD12_VCO_SXT) R33.2
NetC93_1: C93.1 FR16.2 IC1.G5(VDD12_TXBUF)
NetC94_1: C94.1 FR16.1 R32.1
NetC95_1: C95.1 FR35.1 IC1.C21(VDD14_VCO_CGEN)
NetC96_1: C96.1 FR33.1 IC1.AF2(VDD14_TIA_RFE)
NetC97_1: C97.1 FR32.1 IC1.AD4(VDD14_RBB)
NetC98_1: C98.1 FR28.2 FR29.2 IC1.L5(VDD_DIV_SXT) R39.2
NetC99_1: C99.1 FR34.1 IC1.AF6(VDD14_LNA_RFE)
NetC100_1: C100.1 FR30.1 FR31.1 IC1.AN17(VDD_MXLOBUF_RFE)
NetIC1_D6: IC1.D6(VDDO_TLOBUF_TRF) R38.2
NetIC1_J5: IC1.J5(VDD12O_VCO_SXT) R33.1
NetIC1_K2: IC1.K2(VDDO_DIV_SXT) R39.1

### Notes on the sheet
- Number of NF elements on sheet: 2
- NF elements on sheet: FR29, FR31
- LMS7002M power supply circuit
- NF
- (near FR31) NF
- Project name:
- Title:
- Size:
- Date:
- A3
- Revision:
- Time:
- Sheet
- of
- File:
- (in symbol LMS7002Mr3, part E) LMS7002M Power; Part 5/7; 1.8V Digital; 1.8V-3.3V Digital; 1.8V Analog; 1.8V-3.3V Analog
- (in symbol LMS7002Mr3, part F) LMS7002M Power; Part 6/7; 1.25V Digital; 1.25V Analog; 1.25V-1.4V Analog; 1.4V Analog
- (in symbol LMS7002Mr3, part G) LMS7002M GND; Part 7/7; Digital gnd; Analog gnd; Thermal pad

### Library data of the parts
C42 C44 C46 C48 C50 C52-C64 C66 C68 C70 C72-C100 = Cap_0402: Manufacturer: TDK Corporation; Manufacturer Part Number 1: C0603X5R0J105M030BC; Part Description: 1µF ±20% 6.3V X5R Ceramic Capacitor -55°C ~ 85°C Surface Mount, MLCC 0201 (0603 Metric) 0.024" L x 0.012" W (0.60mm x 0.30mm); Capacitance: 1.0µF; Voltage - Rated: 6.3V; Temperature Coefficient: X5R; Value: 1uF, 20%; Supplier 1: Digi-Key; Supplier Part Number 1: 445-8008-1-ND; Applications: General Purpose; Features: -; Lead Style: -; Ratings: -; Thickness (Max): -; Lead Spacing: -; Height - Seated (Max): -; Size / Dimension: 0.024" L x 0.012" W (0.60mm x 0.30mm); Mounting Type: Surface Mount, MLCC; Operating Temperature: -55°C ~ 85°C; Package / Case: 0201 (0603 Metric); Tolerance: ±20%; Packaging: Cut Tape (CT); Category: Capacitors; RoHS: RoHS Compliant
C43 C45 C47 C49 C51 C65 C67 C69 C71 = Cap_0402: Manufacturer Part Number 1: C0603X7R1E102K030BA; Manufacturer: TDK Corporation; Part Description: 1000pF ±10% 25V X7R Ceramic Capacitor -55°C ~ 125°C Surface Mount, MLCC 0201 (0603 Metric) 0.024" L x 0.012" W (0.60mm x 0.30mm); Voltage - Rated: 25V; Temperature Coefficient: X7R; Capacitance: 1000pF; Value: 1nF, 10%; Supplier 1: Digi-Key; Supplier Part Number 1: 445-7275-1-ND; Features: -; Package / Case: 0201 (0603 Metric); Lead Spacing: -; Mounting Type: Surface Mount, MLCC; Lead Style: -; Height - Seated (Max): -; Operating Temperature: -55°C ~ 125°C; Tolerance: ±10%; Size / Dimension: 0.024" L x 0.012" W (0.60mm x 0.30mm); Applications: General Purpose; Ratings: -; Thickness (Max): 0.013" (0.33mm); RoHS: RoHS Compliant; Packaging: Cut Tape (CT); Category: Capacitors
FR1-FR35 = Ferrite: Manufacturer Part Number 1: BK0603TS601-T; Manufacturer: Taiyo Yuden; Part Description: FERRITE BEAD 600 OHM 0201 1LN; DC Resistance (DCR): 750 mOhm Max; Filter Type: Differential Mode - Single; Impedance @ Frequency: 600 Ohm @ 100MHz; Current Rating: 270mA; Supplier 1: Digi-Key; Supplier Part Number 1: 587-3277-1-ND; Size / Dimension: 0.024" L x 0.012" W (0.60mm x 0.30mm); Package / Case: 0201 (0603 Metric); Height (Max): 0.013" (0.33mm); Mounting Type: Surface Mount; Packaging: Cut Tape (CT); RoHS: RoHS Compliant; Category: Filters; Value: 600R, 0.27A
IC1 = LMS7002Mr3: as IC1 on sheet 06_LMS7002M_RF2; Supplier 1: Lime Microsystems; Supplier Part Number 1: LMS7002M; Manufacturer Part Number 1: LMS7002M
R20 R33-R35 R37-R39 = Res_0402: Manufacturer Part Number 1: MCR006YRTJ000; Manufacturer: Rohm Semiconductor; Part Description: RES SMD 0.0OHM JUMPER 1/20W 0201; Resistance (Ohms): 0.0; Power (Watts): 0.05W, 1/20W; Tolerance: Jumper; Value: 0R; Supplier 1: Digi-Key; Supplier Part Number 1: RHM0.0CCCT-ND; Number of Terminations: 2; Operating Temperature: -55°C ~ 125°C; Package / Case: 0201 (0603 Metric); Height: 0.010" (0.26mm); Supplier Device Package: 0201 (0603 Metric); Size / Dimension: 0.024" L x 0.012" W (0.60mm x 0.30mm); Temperature Coefficient: -; Category: Resistors; Features: -; RoHS: RoHS Compliant; Composition: Thick Film; Packaging: Cut Tape (CT)
R21-R25 R28-R31 = Res_0402: Manufacturer Part Number 1: RC0402JR-070RL; Manufacturer: Yageo; Part Description: RES SMD 0.0OHM JUMPER 1/16W 0402; Resistance (Ohms): 0.0; Tolerance: Jumper; Power (Watts): 0.063W, 1/16W; Value: 0R; Supplier 1: Digi-Key; Supplier Part Number 1: 311-0.0JRTR-ND; Category: Resistors; Temperature Coefficient: -; Features: Moisture Resistant; Supplier Device Package: 0402; Height: 0.016" (0.40mm); Package / Case: 0402 (1005 Metric); Operating Temperature: -55°C ~ 155°C; Size / Dimension: 0.039" L x 0.020" W (1.00mm x 0.50mm); Composition: Thick Film; Packaging: Tape & Reel (TR); Number of Terminations: 2; RoHS: RoHS Compliant
R26 R27 R32 R36 = Res_0402: Manufacturer: Panasonic Electronic Components; Manufacturer Part Number: ERJ-1GEF10R0C; Part Description: RES SMD 10 OHM 1% 1/20W 0201; Power (Watts): 0.05W, 1/20W; Resistance (Ohms): 10; Tolerance: ±1%; Temperature Coefficient: ±200ppm/°C; Value: 10R; Supplier 1: Digi-Key; Supplier Part Number 1: P10.0ABCT-ND; Package / Case: 0201 (0603 Metric); Height: 0.010" (0.26mm); Supplier Device Package: 0201; Packaging: Cut Tape (CT); Composition: Thick Film; Category: Resistors; Number of Terminations: 2; Size / Dimension: 0.024" L x 0.012" W (0.60mm x 0.30mm); Operating Temperature: -55°C ~ 125°C; Features: -; RoHS: RoHS Compliant

## Sheet 08_FPGA_banks_3_4_5.SchDoc: FPGA banks 3, 4, 5
size A3; Organization: Lime Microsystems; Address1: Surrey Tech Centre; Address2: Guildford GU2 7YG; Address3: Surrey; Address4: United Kingdom; Revision: v1.3; SheetNumber: 8; SheetTotal: 16
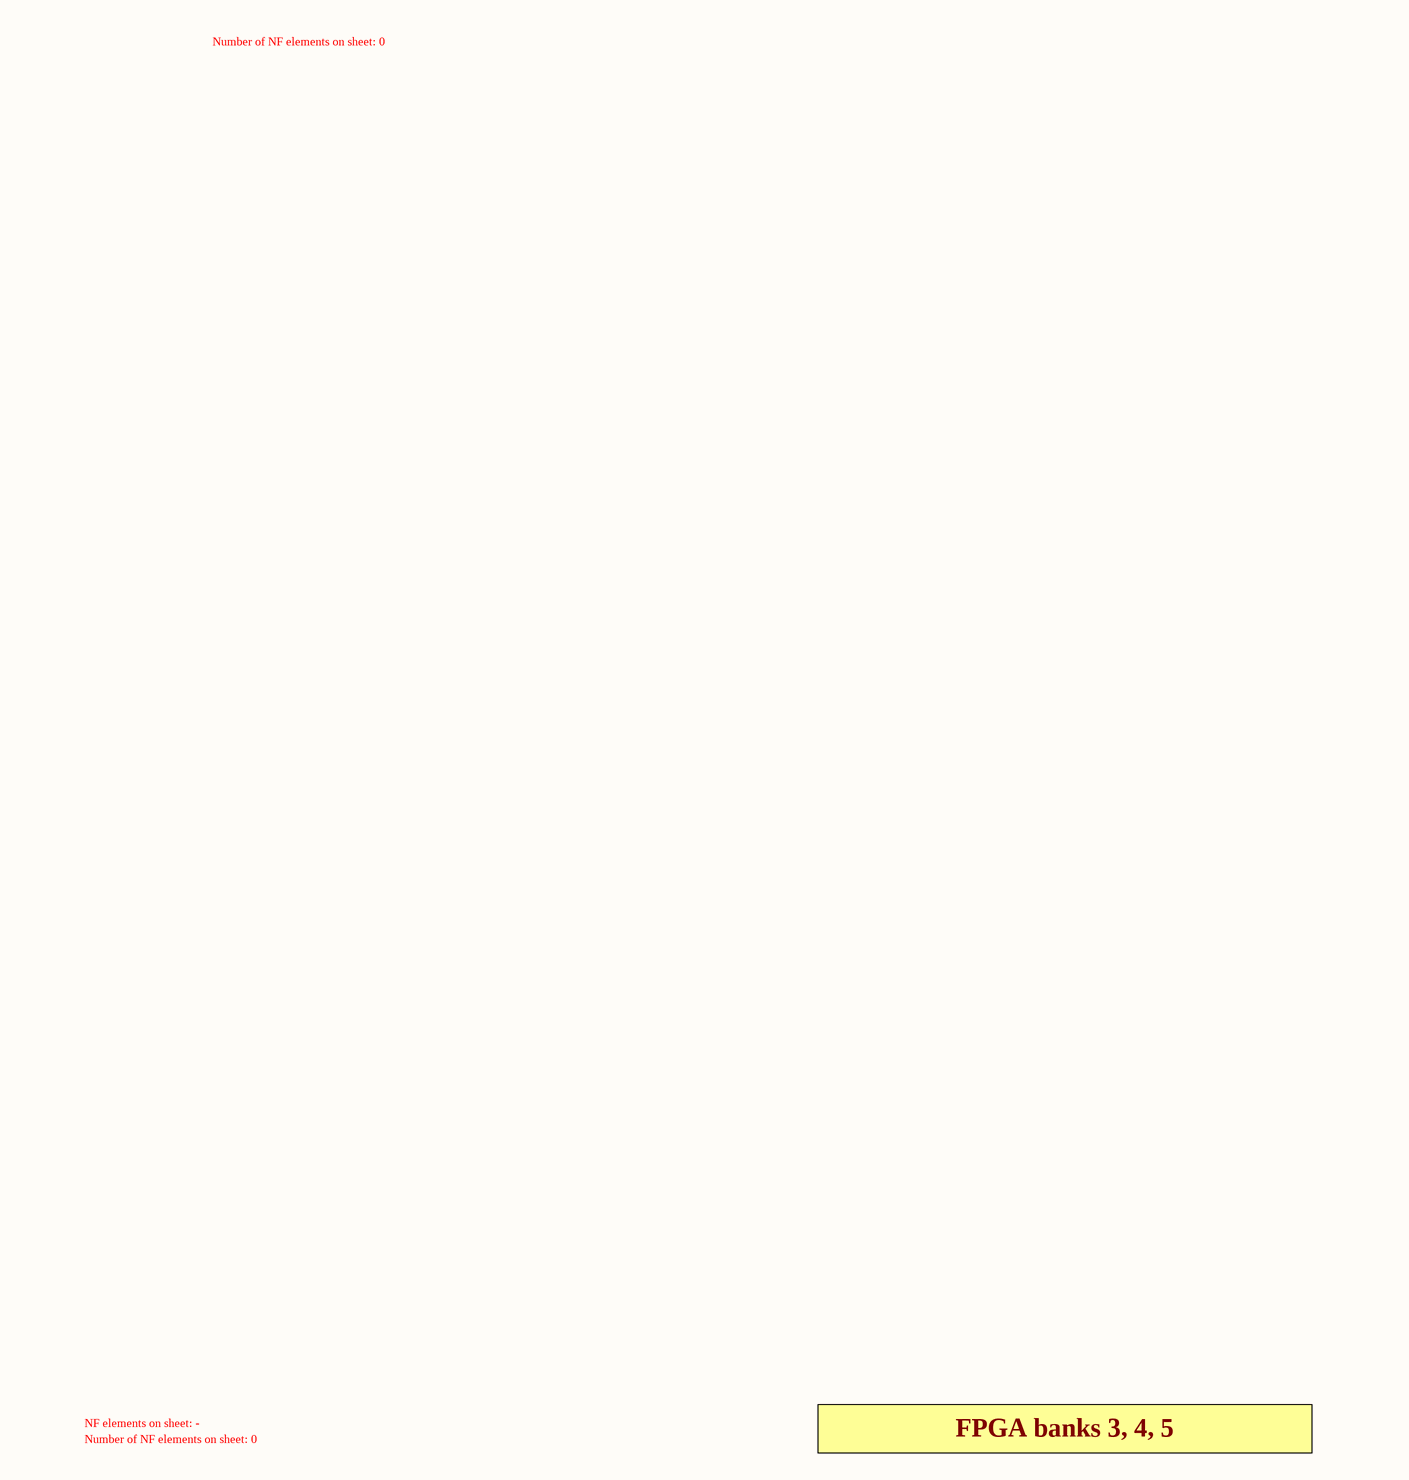
[diagram p7: 08_FPGA_banks_3_4_5.SchDoc, top]
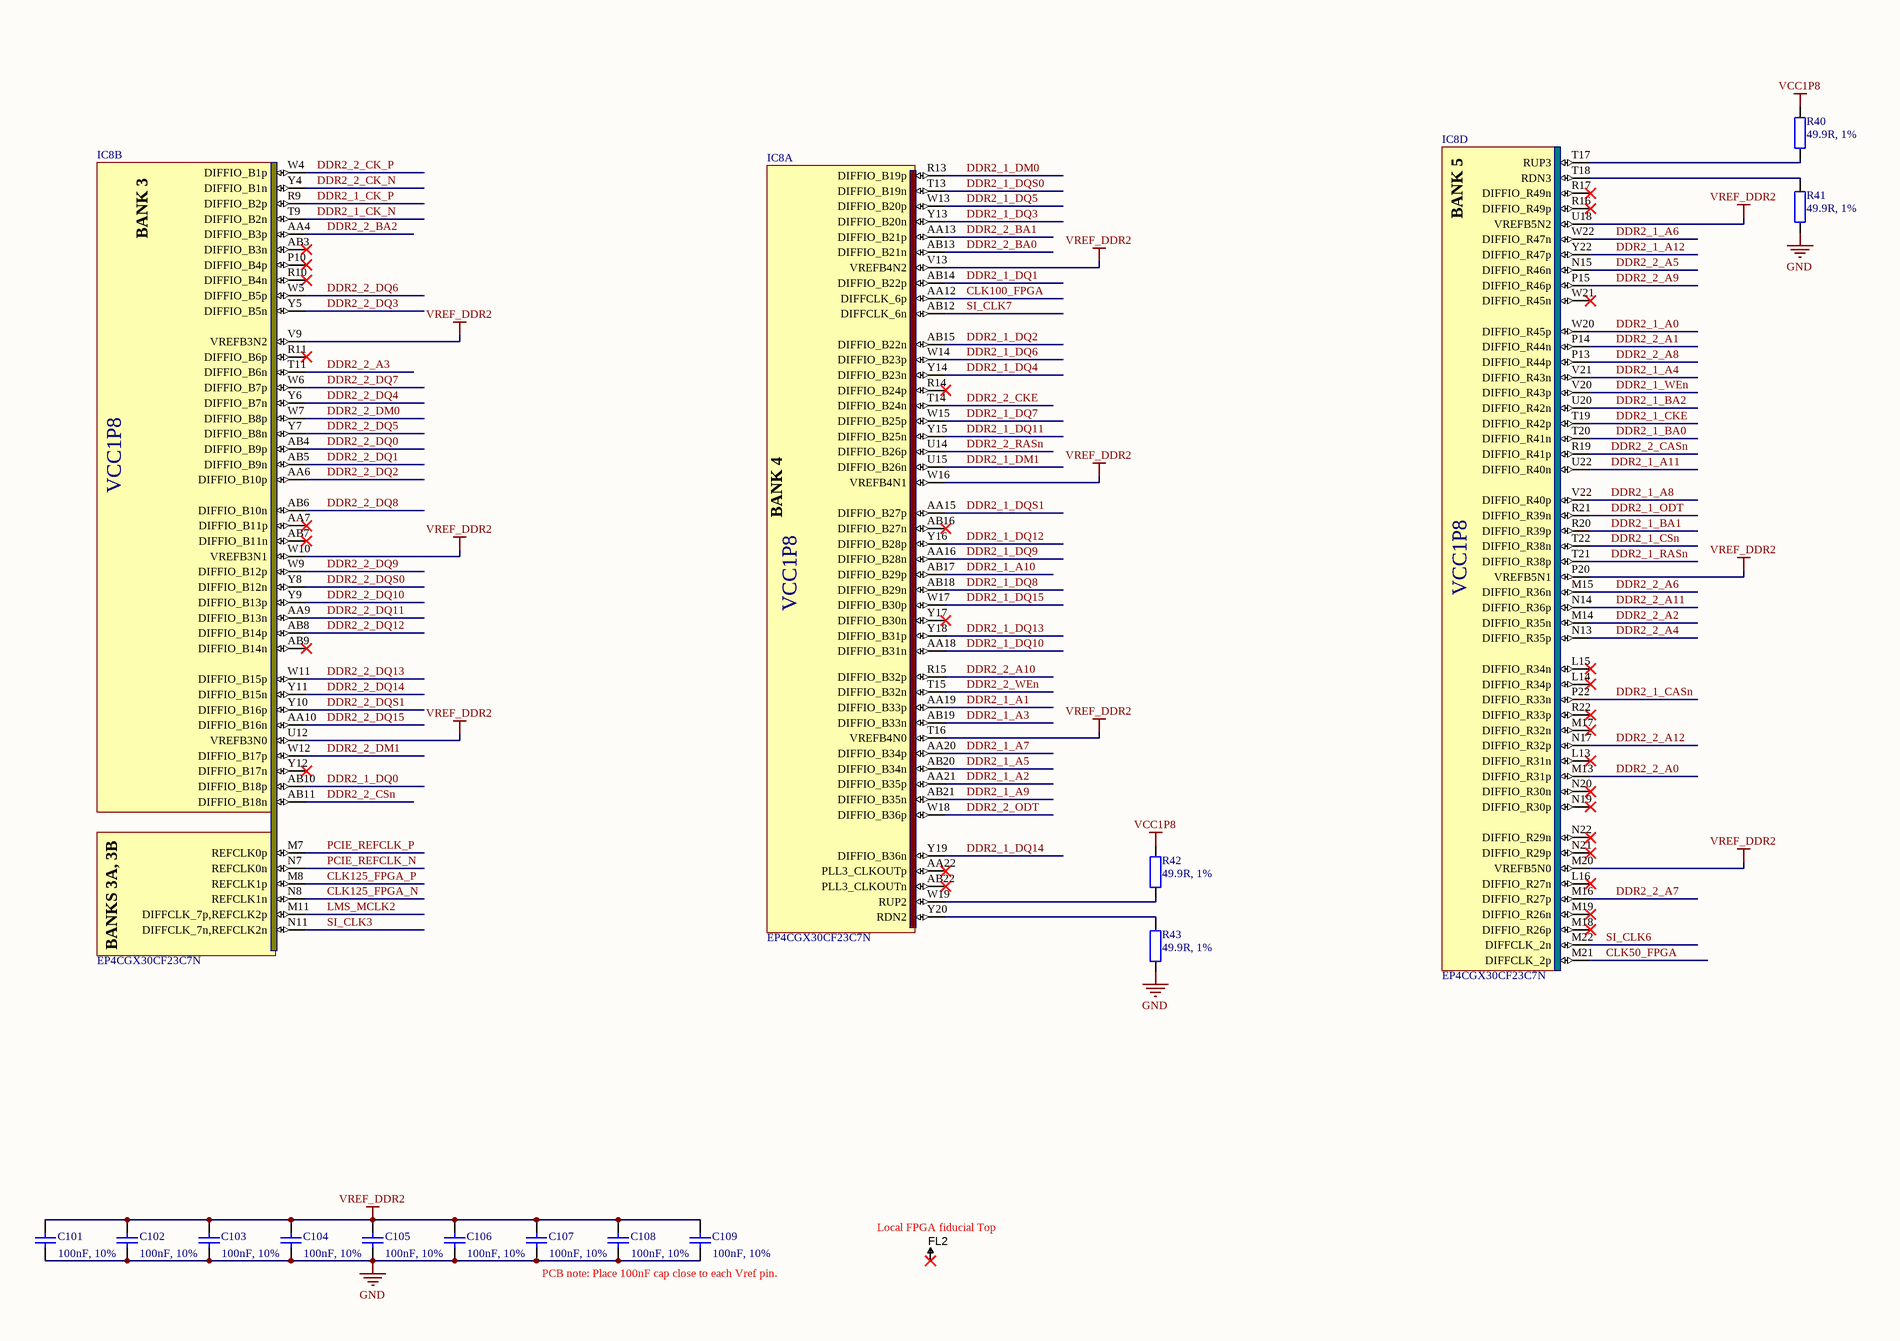
[diagram p8: 08_FPGA_banks_3_4_5.SchDoc, bottom]

### Parts
C101  100nF, 10%  [CAP0402]
C102  100nF, 10%  [CAP0402]
C103  100nF, 10%  [CAP0402]
C104  100nF, 10%  [CAP0402]
C105  100nF, 10%  [CAP0402]
C106  100nF, 10%  [CAP0402]
C107  100nF, 10%  [CAP0402]
C108  100nF, 10%  [CAP0402]
C109  100nF, 10%  [CAP0402]
FL2  Fiducial  [Fiducial_local]  (value not drawn)
IC8  EP4CGX30CF23C7N  [ALTR-FBGA484_A-200]  (parts A,B,D of 10)
R40  49.9R, 1%  [RES0402]
R41  49.9R, 1%  [RES0402]
R42  49.9R, 1%  [RES0402]
R43  49.9R, 1%  [RES0402]

### Nets
GND: C101.2 C102.2 C103.2 C104.2 C105.2 C106.2 C107.2 C108.2 C109.2 R41.1 R43.1
VCC1P8: R40.2 R42.2
VREF_DDR2: C101.1 C102.1 C103.1 C104.1 C105.1 C106.1 C107.1 C108.1 C109.1 IC8.M20(VREFB5N0) IC8.P20(VREFB5N1) IC8.T16(VREFB4N0) IC8.U12(VREFB3N0) IC8.U18(VREFB5N2) IC8.V9(VREFB3N2) IC8.V13(VREFB4N2) IC8.W10(VREFB3N1) IC8.W16(VREFB4N1)
CLK50_FPGA: IC8.M21(DIFFCLK_2p)
CLK100_FPGA: IC8.AA12(DIFFCLK_6p)
CLK125_FPGA_N: IC8.N8(REFCLK1n)
CLK125_FPGA_P: IC8.M8(REFCLK1p)
DDR2_1_A0: IC8.W20(DIFFIO_R45p)
DDR2_1_A1: IC8.AA19(DIFFIO_B33p)
DDR2_1_A2: IC8.AA21(DIFFIO_B35p)
DDR2_1_A3: IC8.AB19(DIFFIO_B33n)
DDR2_1_A4: IC8.V21(DIFFIO_R43n)
DDR2_1_A5: IC8.AB20(DIFFIO_B34n)
DDR2_1_A6: IC8.W22(DIFFIO_R47n)
DDR2_1_A7: IC8.AA20(DIFFIO_B34p)
DDR2_1_A8: IC8.V22(DIFFIO_R40p)
DDR2_1_A9: IC8.AB21(DIFFIO_B35n)
DDR2_1_A10: IC8.AB17(DIFFIO_B29p)
DDR2_1_A11: IC8.U22(DIFFIO_R40n)
DDR2_1_A12: IC8.Y22(DIFFIO_R47p)
DDR2_1_BA0: IC8.T20(DIFFIO_R41n)
DDR2_1_BA1: IC8.R20(DIFFIO_R39p)
DDR2_1_BA2: IC8.U20(DIFFIO_R42n)
DDR2_1_CASn: IC8.P22(DIFFIO_R33n)
DDR2_1_CK_N: IC8.T9(DIFFIO_B2n)
DDR2_1_CK_P: IC8.R9(DIFFIO_B2p)
DDR2_1_CKE: IC8.T19(DIFFIO_R42p)
DDR2_1_CSn: IC8.T22(DIFFIO_R38n)
DDR2_1_DM0: IC8.R13(DIFFIO_B19p)
DDR2_1_DM1: IC8.U15(DIFFIO_B26n)
DDR2_1_DQ0: IC8.AB10(DIFFIO_B18p)
DDR2_1_DQ1: IC8.AB14(DIFFIO_B22p)
DDR2_1_DQ2: IC8.AB15(DIFFIO_B22n)
DDR2_1_DQ3: IC8.Y13(DIFFIO_B20n)
DDR2_1_DQ4: IC8.Y14(DIFFIO_B23n)
DDR2_1_DQ5: IC8.W13(DIFFIO_B20p)
DDR2_1_DQ6: IC8.W14(DIFFIO_B23p)
DDR2_1_DQ7: IC8.W15(DIFFIO_B25p)
DDR2_1_DQ8: IC8.AB18(DIFFIO_B29n)
DDR2_1_DQ9: IC8.AA16(DIFFIO_B28n)
DDR2_1_DQ10: IC8.AA18(DIFFIO_B31n)
DDR2_1_DQ11: IC8.Y15(DIFFIO_B25n)
DDR2_1_DQ12: IC8.Y16(DIFFIO_B28p)
DDR2_1_DQ13: IC8.Y18(DIFFIO_B31p)
DDR2_1_DQ14: IC8.Y19(DIFFIO_B36n)
DDR2_1_DQ15: IC8.W17(DIFFIO_B30p)
DDR2_1_DQS0: IC8.T13(DIFFIO_B19n)
DDR2_1_DQS1: IC8.AA15(DIFFIO_B27p)
DDR2_1_ODT: IC8.R21(DIFFIO_R39n)
DDR2_1_RASn: IC8.T21(DIFFIO_R38p)
DDR2_1_WEn: IC8.V20(DIFFIO_R43p)
DDR2_2_A0: IC8.M13(DIFFIO_R31p)
DDR2_2_A1: IC8.P14(DIFFIO_R44n)
DDR2_2_A2: IC8.M14(DIFFIO_R35n)
DDR2_2_A3: IC8.T11(DIFFIO_B6n)
DDR2_2_A4: IC8.N13(DIFFIO_R35p)
DDR2_2_A5: IC8.N15(DIFFIO_R46n)
DDR2_2_A6: IC8.M15(DIFFIO_R36n)
DDR2_2_A7: IC8.M16(DIFFIO_R27p)
DDR2_2_A8: IC8.P13(DIFFIO_R44p)
DDR2_2_A9: IC8.P15(DIFFIO_R46p)
DDR2_2_A10: IC8.R15(DIFFIO_B32p)
DDR2_2_A11: IC8.N14(DIFFIO_R36p)
DDR2_2_A12: IC8.N17(DIFFIO_R32p)
DDR2_2_BA0: IC8.AB13(DIFFIO_B21n)
DDR2_2_BA1: IC8.AA13(DIFFIO_B21p)
DDR2_2_BA2: IC8.AA4(DIFFIO_B3p)
DDR2_2_CASn: IC8.R19(DIFFIO_R41p)
DDR2_2_CK_N: IC8.Y4(DIFFIO_B1n)
DDR2_2_CK_P: IC8.W4(DIFFIO_B1p)
DDR2_2_CKE: IC8.T14(DIFFIO_B24n)
DDR2_2_CSn: IC8.AB11(DIFFIO_B18n)
DDR2_2_DM0: IC8.W7(DIFFIO_B8p)
DDR2_2_DM1: IC8.W12(DIFFIO_B17p)
DDR2_2_DQ0: IC8.AB4(DIFFIO_B9p)
DDR2_2_DQ1: IC8.AB5(DIFFIO_B9n)
DDR2_2_DQ2: IC8.AA6(DIFFIO_B10p)
DDR2_2_DQ3: IC8.Y5(DIFFIO_B5n)
DDR2_2_DQ4: IC8.Y6(DIFFIO_B7n)
DDR2_2_DQ5: IC8.Y7(DIFFIO_B8n)
DDR2_2_DQ6: IC8.W5(DIFFIO_B5p)
DDR2_2_DQ7: IC8.W6(DIFFIO_B7p)
DDR2_2_DQ8: IC8.AB6(DIFFIO_B10n)
DDR2_2_DQ9: IC8.W9(DIFFIO_B12p)
DDR2_2_DQ10: IC8.Y9(DIFFIO_B13p)
DDR2_2_DQ11: IC8.AA9(DIFFIO_B13n)
DDR2_2_DQ12: IC8.AB8(DIFFIO_B14p)
DDR2_2_DQ13: IC8.W11(DIFFIO_B15p)
DDR2_2_DQ14: IC8.Y11(DIFFIO_B15n)
DDR2_2_DQ15: IC8.AA10(DIFFIO_B16n)
DDR2_2_DQS0: IC8.Y8(DIFFIO_B12n)
DDR2_2_DQS1: IC8.Y10(DIFFIO_B16p)
DDR2_2_ODT: IC8.W18(DIFFIO_B36p)
DDR2_2_RASn: IC8.U14(DIFFIO_B26p)
DDR2_2_WEn: IC8.T15(DIFFIO_B32n)
LMS_MCLK2: IC8.M11(DIFFCLK_7p,REFCLK2p)
PCIE_REFCLK_N: IC8.N7(REFCLK0n)
PCIE_REFCLK_P: IC8.M7(REFCLK0p)
SI_CLK3: IC8.N11(DIFFCLK_7n,REFCLK2n)
SI_CLK6: IC8.M22(DIFFCLK_2n)
SI_CLK7: IC8.AB12(DIFFCLK_6n)
NetIC8_T17: IC8.T17(RUP3) R40.1
NetIC8_T18: IC8.T18(RDN3) R41.2
NetIC8_W19: IC8.W19(RUP2) R42.1
NetIC8_Y20: IC8.Y20(RDN2) R43.2

Not connected (* = marked no-connect by the designer): FL2 1*; IC8 AA7(DIFFIO_B11p)* AA22(PLL3_CLKOUTp)* AB3(DIFFIO_B3n)* AB7(DIFFIO_B11n)* AB9(DIFFIO_B14n)* AB16(DIFFIO_B27n)* AB22(PLL3_CLKOUTn)* L13(DIFFIO_R31n)* L14(DIFFIO_R34p)* L15(DIFFIO_R34n)* L16(DIFFIO_R27n)* M17(DIFFIO_R32n)* M18(DIFFIO_R26p)* M19(DIFFIO_R26n)* N19(DIFFIO_R30p)* N20(DIFFIO_R30n)* N21(DIFFIO_R29p)* N22(DIFFIO_R29n)* P10(DIFFIO_B4p)* R10(DIFFIO_B4n)* R11(DIFFIO_B6p)* R14(DIFFIO_B24p)* R16(DIFFIO_R49p)* R17(DIFFIO_R49n)* R22(DIFFIO_R33p)* W21(DIFFIO_R45n)* Y12(DIFFIO_B17n)* Y17(DIFFIO_B30n)*

### Notes on the sheet
- Number of NF elements on sheet: 0
- NF elements on sheet: -
- FPGA banks 3, 4, 5
- VCC1P8
- (near FL2) Local FPGA fiducial Top
- PCB note: Place 100nF cap close to each Vref pin.
- Project name:
- Title:
- Size:
- Date:
- A3
- Revision:
- Time:
- Sheet
- of
- File:
- (in symbol EP4CGX30CF23C7N, part A) BANK 4
- (in symbol EP4CGX30CF23C7N, part B) BANK 3; BANKS 3A, 3B
- (in symbol EP4CGX30CF23C7N, part D) BANK 5

### Library data of the parts
C101-C109 = Cap_0603: Manufacturer Part Number 1: GRM155R71C104KA88D; Part Description: 0.10µF ±10% 16V X7R Ceramic Capacitor -55°C ~ 125°C Surface Mount, MLCC 0402 (1005 Metric) 0.039" L x 0.020" W (1.00mm x 0.50mm); Brand: Murata Electronics; Type: General Purpose MLCC; Capacitance: 0.1 uF; Temperature Coefficient / Code: +/- 15 %; Voltage Rating DC: 16 V; Case Height: 0.5 mm; Case Length: 1 mm; Dielectric: X7R; Supplier 1: Mouser; Supplier Part Number 1: 81-GRM155R71C104KA88; Tolerance: 10 %; Case Code - in: 0402; Manufacturer: Murata Electronics; Category: Multilayer Ceramic Capacitors MLCC - SMD/SMT; Value: 100nF, 10%; Manufacturer Part Number: GRM155R71C104KA88D; Case Code - mm: 1005; Case Width: 0.5 mm; Maximum Operating Temperature: + 125 C; Minimum Operating Temperature: - 55 C; Minimum Order Quantity: 1; Operating Temperature Range: - 55 C to + 125 C; Package / Case: 0402 (1005 metric); Packaging: Reel; Product: General Type MLCCs; Product Category: Low & Medium Capacitance SMD Ceramic Chip Capacitors; Reeling: True; RoHS - Mouser: Y; RoHS: RoHS Compliant; Series: GRM; Standard Pack Qty: 10000; Termination Style: SMD/SMT
IC8 = EP4CGX30CF23C7N: Manufacturer: Altera; Part Description: IC FPGA 290 I/O 484FBGA; Voltage - Supply: 1.16 V ~ 1.24 V; Number of I/O: 290; Total RAM Bits: 1105920; Number of Logic Elements/Cells: 29440; Number of LABs/CLBs: 1840; Supplier 1: Digi-Key; Package / Case: 484-BGA; Operating Temperature: 0°C ~ 85°C; Mounting Type: Surface Mount; Number of Gates: -; Supplier Device Package: 484-FBGA (23x23); Category: Integrated Circuits (ICs); RoHS: RoHS Compliant; Supplier Part Number 1: 544-2730-ND; Manufacturer Part Number 1: EP4CGX30CF23C7N
R40-R43 = Res_0402: as R6 on sheet 04_LMS7002M_Misc; Number of Terminations: 2; Size / Dimension: 0.039" L x 0.020" W (1.00mm x 0.50mm); Supplier Device Package: 0402 (1005 Metric); RoHS: RoHS Compliant; Supplier Part Number 1: 1276-3469-6-ND; Features: -; Packaging: Digi-Reel®; Tolerance: ±1%; Height: 0.016" (0.40mm); Category: Resistors; Composition: Thick Film; Package / Case: 0402 (1005 Metric); Supplier 1: Digi-Key; Operating Temperature: -55°C ~ 155°C; Value: 49.9R, 1%

## Sheet 09_FPGA_banks_6_7_8.SchDoc: FPGA banks 6, 7, 8
size A3; Organization: Lime Microsystems; Address1: Surrey Tech Centre; Address2: Guildford GU2 7YG; Address3: Surrey; Address4: United Kingdom; Revision: v1.3; SheetNumber: 9; SheetTotal: 16
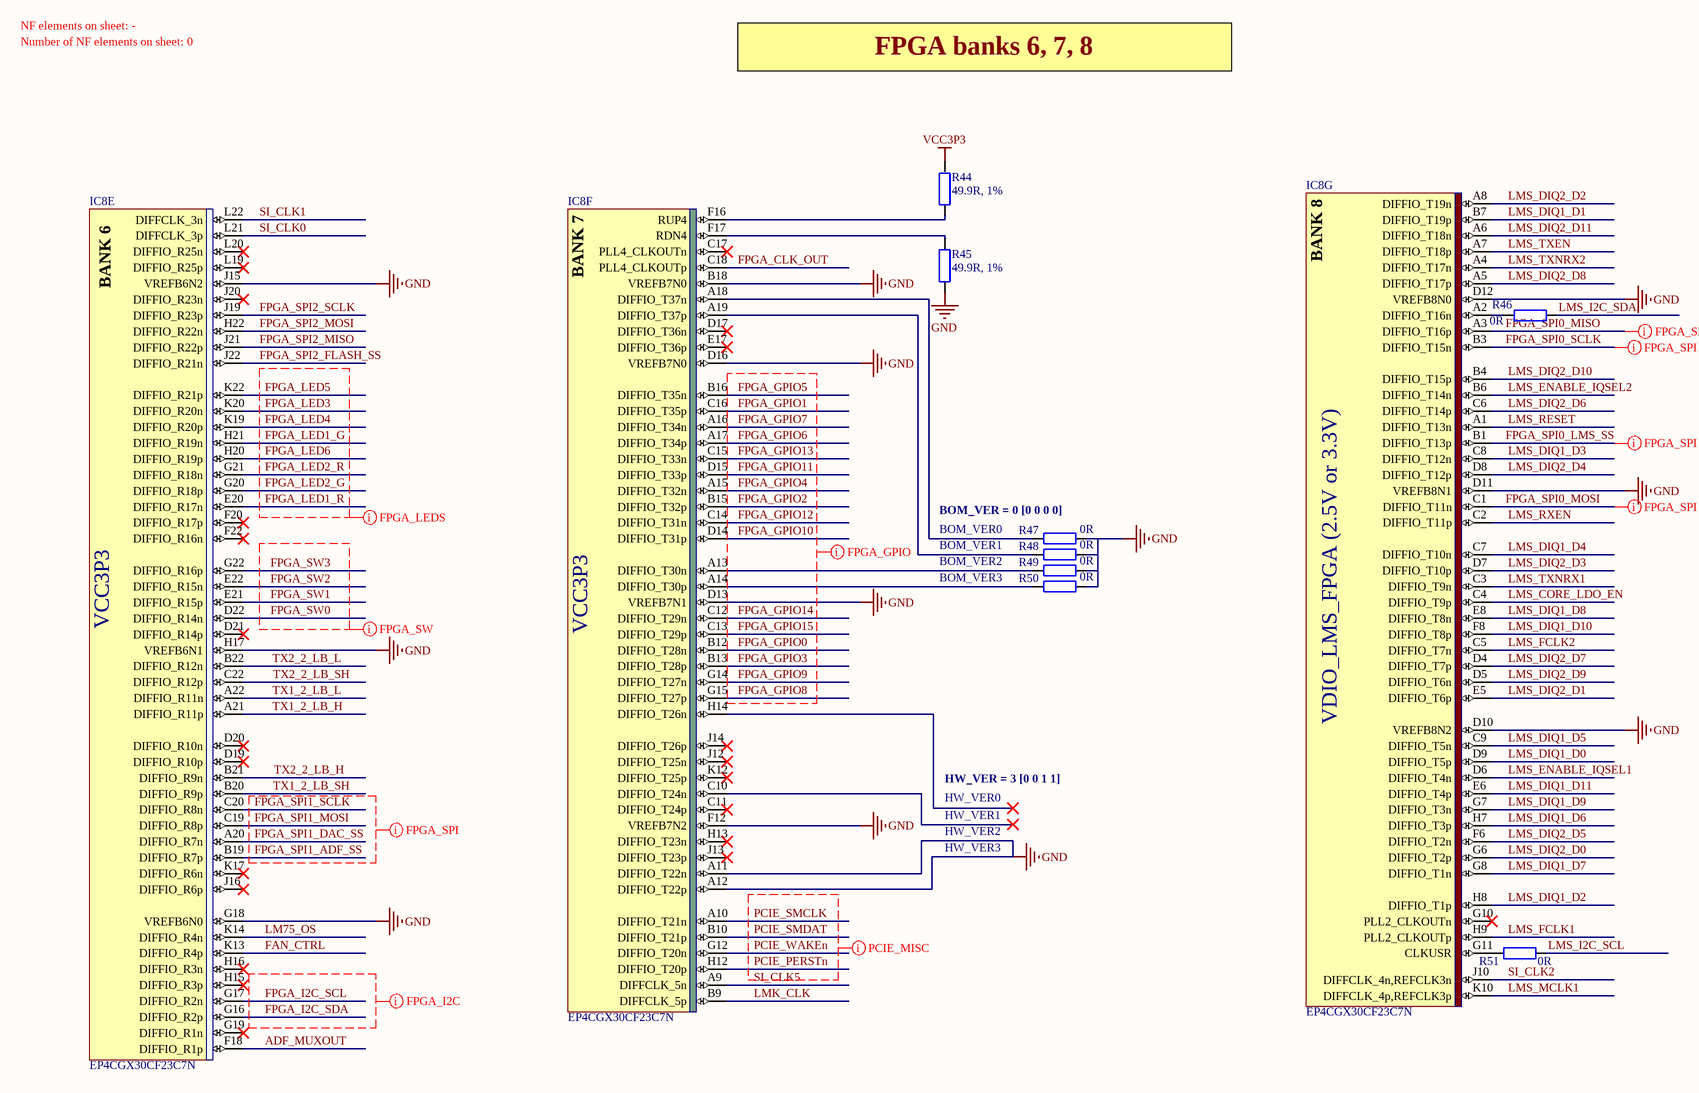
[diagram p9: 09_FPGA_banks_6_7_8.SchDoc]

### Parts
IC8  EP4CGX30CF23C7N  [ALTR-FBGA484_A-200]  (parts E,F,G of 10)
R44  49.9R, 1%  [RES0402]
R45  49.9R, 1%  [RES0402]
R46  0R  [RES0402]
R47  0R  [RES0402]
R48  0R  [RES0402]
R49  0R  [RES0402]
R50  0R  [RES0402]
R51  0R  [RES0402]

### Nets
GND: IC8.A11(DIFFIO_T22n) IC8.A12(DIFFIO_T22p) IC8.B18(VREFB7N0) IC8.D10(VREFB8N2) IC8.D11(VREFB8N1) IC8.D12(VREFB8N0) IC8.D13(VREFB7N1) IC8.D16(VREFB7N0) IC8.F12(VREFB7N2) IC8.G18(VREFB6N0) IC8.H17(VREFB6N1) IC8.J15(VREFB6N2) R45.1 R47.1 R48.1 R49.1 R50.1
VCC3P3: R44.2
ADF_MUXOUT: IC8.F18(DIFFIO_R1p)
FAN_CTRL: IC8.K13(DIFFIO_R4p)
FPGA_CLK_OUT: IC8.C18(PLL4_CLKOUTp)
FPGA_GPIO0: IC8.B12(DIFFIO_T28n)
FPGA_GPIO1: IC8.C16(DIFFIO_T35p)
FPGA_GPIO2: IC8.B15(DIFFIO_T32p)
FPGA_GPIO3: IC8.B13(DIFFIO_T28p)
FPGA_GPIO4: IC8.A15(DIFFIO_T32n)
FPGA_GPIO5: IC8.B16(DIFFIO_T35n)
FPGA_GPIO6: IC8.A17(DIFFIO_T34p)
FPGA_GPIO7: IC8.A16(DIFFIO_T34n)
FPGA_GPIO8: IC8.G15(DIFFIO_T27p)
FPGA_GPIO9: IC8.G14(DIFFIO_T27n)
FPGA_GPIO10: IC8.D14(DIFFIO_T31p)
FPGA_GPIO11: IC8.D15(DIFFIO_T33p)
FPGA_GPIO12: IC8.C14(DIFFIO_T31n)
FPGA_GPIO13: IC8.C15(DIFFIO_T33n)
FPGA_GPIO14: IC8.C12(DIFFIO_T29n)
FPGA_GPIO15: IC8.C13(DIFFIO_T29p)
FPGA_I2C_SCL: IC8.G17(DIFFIO_R2n)
FPGA_I2C_SDA: IC8.G16(DIFFIO_R2p)
FPGA_LED1_G: IC8.H21(DIFFIO_R19n)
FPGA_LED1_R: IC8.E20(DIFFIO_R17n)
FPGA_LED2_G: IC8.G20(DIFFIO_R18p)
FPGA_LED2_R: IC8.G21(DIFFIO_R18n)
FPGA_LED3: IC8.K20(DIFFIO_R20n)
FPGA_LED4: IC8.K19(DIFFIO_R20p)
FPGA_LED5: IC8.K22(DIFFIO_R21p)
FPGA_LED6: IC8.H20(DIFFIO_R19p)
FPGA_SPI0_LMS_SS: IC8.B1(DIFFIO_T13p)
FPGA_SPI0_MISO: IC8.A3(DIFFIO_T16p)
FPGA_SPI0_MOSI: IC8.C1(DIFFIO_T11n)
FPGA_SPI0_SCLK: IC8.B3(DIFFIO_T15n)
FPGA_SPI1_ADF_SS: IC8.B19(DIFFIO_R7p)
FPGA_SPI1_DAC_SS: IC8.A20(DIFFIO_R7n)
FPGA_SPI1_MOSI: IC8.C19(DIFFIO_R8p)
FPGA_SPI1_SCLK: IC8.C20(DIFFIO_R8n)
FPGA_SPI2_FLASH_SS: IC8.J22(DIFFIO_R21n)
FPGA_SPI2_MISO: IC8.J21(DIFFIO_R22p)
FPGA_SPI2_MOSI: IC8.H22(DIFFIO_R22n)
FPGA_SPI2_SCLK: IC8.J19(DIFFIO_R23p)
FPGA_SW0: IC8.D22(DIFFIO_R14n)
FPGA_SW1: IC8.E21(DIFFIO_R15p)
FPGA_SW2: IC8.E22(DIFFIO_R15n)
FPGA_SW3: IC8.G22(DIFFIO_R16p)
LM75_OS: IC8.K14(DIFFIO_R4n)
LMK_CLK: IC8.B9(DIFFCLK_5p)
LMS_CORE_LDO_EN: IC8.C4(DIFFIO_T9p)
LMS_DIQ1_D0: IC8.D9(DIFFIO_T5p)
LMS_DIQ1_D1: IC8.B7(DIFFIO_T19p)
LMS_DIQ1_D2: IC8.H8(DIFFIO_T1p)
LMS_DIQ1_D3: IC8.C8(DIFFIO_T12n)
LMS_DIQ1_D4: IC8.C7(DIFFIO_T10n)
LMS_DIQ1_D5: IC8.C9(DIFFIO_T5n)
LMS_DIQ1_D6: IC8.H7(DIFFIO_T3p)
LMS_DIQ1_D7: IC8.G8(DIFFIO_T1n)
LMS_DIQ1_D8: IC8.E8(DIFFIO_T8n)
LMS_DIQ1_D9: IC8.G7(DIFFIO_T3n)
LMS_DIQ1_D10: IC8.F8(DIFFIO_T8p)
LMS_DIQ1_D11: IC8.E6(DIFFIO_T4p)
LMS_DIQ2_D0: IC8.G6(DIFFIO_T2p)
LMS_DIQ2_D1: IC8.E5(DIFFIO_T6p)
LMS_DIQ2_D2: IC8.A8(DIFFIO_T19n)
LMS_DIQ2_D3: IC8.D7(DIFFIO_T10p)
LMS_DIQ2_D4: IC8.D8(DIFFIO_T12p)
LMS_DIQ2_D5: IC8.F6(DIFFIO_T2n)
LMS_DIQ2_D6: IC8.C6(DIFFIO_T14p)
LMS_DIQ2_D7: IC8.D4(DIFFIO_T7p)
LMS_DIQ2_D8: IC8.A5(DIFFIO_T17p)
LMS_DIQ2_D9: IC8.D5(DIFFIO_T6n)
LMS_DIQ2_D10: IC8.B4(DIFFIO_T15p)
LMS_DIQ2_D11: IC8.A6(DIFFIO_T18n)
LMS_ENABLE_IQSEL1: IC8.D6(DIFFIO_T4n)
LMS_ENABLE_IQSEL2: IC8.B6(DIFFIO_T14n)
LMS_FCLK1: IC8.H9(PLL2_CLKOUTp)
LMS_FCLK2: IC8.C5(DIFFIO_T7n)
LMS_I2C_SCL: R51.1
LMS_I2C_SDA: R46.1
LMS_MCLK1: IC8.K10(DIFFCLK_4p,REFCLK3p)
LMS_RESET: IC8.A1(DIFFIO_T13n)
LMS_RXEN: IC8.C2(DIFFIO_T11p)
LMS_TXEN: IC8.A7(DIFFIO_T18p)
LMS_TXNRX1: IC8.C3(DIFFIO_T9n)
LMS_TXNRX2: IC8.A4(DIFFIO_T17n)
PCIE_PERSTn: IC8.H12(DIFFIO_T20p)
PCIE_SMCLK: IC8.A10(DIFFIO_T21n)
PCIE_SMDAT: IC8.B10(DIFFIO_T21p)
PCIE_WAKEn: IC8.G12(DIFFIO_T20n)
SI_CLK0: IC8.L21(DIFFCLK_3p)
SI_CLK1: IC8.L22(DIFFCLK_3n)
SI_CLK2: IC8.J10(DIFFCLK_4n,REFCLK3n)
SI_CLK5: IC8.A9(DIFFCLK_5n)
TX1_2_LB_H: IC8.A21(DIFFIO_R11p)
TX1_2_LB_L: IC8.A22(DIFFIO_R11n)
TX1_2_LB_SH: IC8.B20(DIFFIO_R9p)
TX2_2_LB_H: IC8.B21(DIFFIO_R9n)
TX2_2_LB_L: IC8.B22(DIFFIO_R12n)
TX2_2_LB_SH: IC8.C22(DIFFIO_R12p)
NetIC8_A2: IC8.A2(DIFFIO_T16n) R46.2
NetIC8_A13: IC8.A13(DIFFIO_T30n) R49.2
NetIC8_A14: IC8.A14(DIFFIO_T30p) R50.2
NetIC8_A18: IC8.A18(DIFFIO_T37n) R47.2
NetIC8_A19: IC8.A19(DIFFIO_T37p) R48.2
NetIC8_F16: IC8.F16(RUP4) R44.1
NetIC8_F17: IC8.F17(RDN4) R45.2
NetIC8_G11: IC8.G11(CLKUSR) R51.2

Not connected (* = marked no-connect by the designer): IC8 C10(DIFFIO_T24n)* C11(DIFFIO_T24p)* C17(PLL4_CLKOUTn)* D17(DIFFIO_T36n)* D19(DIFFIO_R10p)* D20(DIFFIO_R10n)* D21(DIFFIO_R14p)* E17(DIFFIO_T36p)* F20(DIFFIO_R17p)* F22(DIFFIO_R16n)* G10(PLL2_CLKOUTn)* G19(DIFFIO_R1n)* H13(DIFFIO_T23n)* H14(DIFFIO_T26n)* H15(DIFFIO_R3p)* H16(DIFFIO_R3n)* J12(DIFFIO_T25n)* J13(DIFFIO_T23p)* J14(DIFFIO_T26p)* J16(DIFFIO_R6p)* J20(DIFFIO_R23n)* K12(DIFFIO_T25p)* K17(DIFFIO_R6n)* L19(DIFFIO_R25p)* L20(DIFFIO_R25n)*

### Layout directives
net class FPGA_GPIO: FPGA_GPIO0, FPGA_GPIO1, FPGA_GPIO2, FPGA_GPIO3, FPGA_GPIO4, FPGA_GPIO5, FPGA_GPIO6, FPGA_GPIO7, FPGA_GPIO8, FPGA_GPIO9, FPGA_GPIO10, FPGA_GPIO11, FPGA_GPIO12, FPGA_GPIO13, FPGA_GPIO14, FPGA_GPIO15
net class FPGA_LEDS: FPGA_LED1_G, FPGA_LED1_R, FPGA_LED2_G, FPGA_LED2_R, FPGA_LED3, FPGA_LED4, FPGA_LED5, FPGA_LED6
net class FPGA_SW: FPGA_SW0, FPGA_SW1, FPGA_SW2, FPGA_SW3
net class PCIE_MISC: PCIE_PERSTn, PCIE_SMCLK, PCIE_SMDAT, PCIE_WAKEn
net class FPGA_SPI: FPGA_SPI0_LMS_SS, FPGA_SPI0_MISO, FPGA_SPI0_MOSI, FPGA_SPI0_SCLK, FPGA_SPI1_ADF_SS, FPGA_SPI1_DAC_SS, FPGA_SPI1_MOSI, FPGA_SPI1_SCLK
net class FPGA_I2C: FPGA_I2C_SCL, FPGA_I2C_SDA

### Notes on the sheet
- NF elements on sheet: -
- Number of NF elements on sheet: 0
- FPGA banks 6, 7, 8
- (near R47) BOM_VER = 0 [0 0 0 0]
- BOM_VER0
- BOM_VER1
- BOM_VER2
- VCC3P3
- BOM_VER3
- VDIO_LMS_FPGA (2.5V or 3.3V)
- HW_VER0
- HW_VER1
- HW_VER2
- HW_VER = 3 [0 0 1 1]
- HW_VER3
- Project name:
- Title:
- Size:
- Date:
- A3
- Revision:
- Time:
- Sheet
- of
- File:
- (in symbol EP4CGX30CF23C7N, part E) BANK 6
- (in symbol EP4CGX30CF23C7N, part F) BANK 7
- (in symbol EP4CGX30CF23C7N, part G) BANK 8

### Library data of the parts
IC8 = EP4CGX30CF23C7N: Manufacturer: Altera; Part Description: IC FPGA 290 I/O 484FBGA; Voltage - Supply: 1.16 V ~ 1.24 V; Number of I/O: 290; Total RAM Bits: 1105920; Number of Logic Elements/Cells: 29440; Number of LABs/CLBs: 1840; Supplier 1: Digi-Key; Package / Case: 484-BGA; Operating Temperature: 0°C ~ 85°C; Mounting Type: Surface Mount; Number of Gates: -; Supplier Device Package: 484-FBGA (23x23); Category: Integrated Circuits (ICs); RoHS: RoHS Compliant; Supplier Part Number 1: 544-2730-ND; Manufacturer Part Number 1: EP4CGX30CF23C7N
R44 R45 = Res_0402: Manufacturer: Samsung Electro-Mechanics America, Inc.; Manufacturer Part Number: RC1005F49R9CS; Part Description: RES SMD 49.9 OHM 1% 1/16W 0402; Temperature Coefficient: ±100ppm/°C; Resistance (Ohms): 49.9; Power (Watts): 0.063W, 1/16W; Number of Terminations: 2; Size / Dimension: 0.039" L x 0.020" W (1.00mm x 0.50mm); Supplier Device Package: 0402 (1005 Metric); RoHS: RoHS Compliant; Supplier Part Number 1: 1276-3469-6-ND; Features: -; Packaging: Digi-Reel®; Tolerance: ±1%; Height: 0.016" (0.40mm); Category: Resistors; Composition: Thick Film; Package / Case: 0402 (1005 Metric); Supplier 1: Digi-Key; Operating Temperature: -55°C ~ 155°C; Value: 49.9R, 1%
R46-R51 = Res_0402: Manufacturer: Yageo; Part Description: RES SMD 0.0OHM JUMPER 1/16W 0402; Supplier 1: Digi-Key; Supplier Part Number 1: 311-0.0JRTR-ND; Composition: Thick Film; Package / Case: 0402 (1005 Metric); Category: Resistors; Value: 0R